# EasyEDA Pro project cap bank - Copy.eprj

# Schematic Schematic1
Board Name: Board1; Create Date: 2025-07-01; Page Name: P1; Project Name: cap bank - Copy; Schematic Name: Schematic1; Update Date: 2025-08-21; Company: EasyEDA.com; Page Size: A4; Version: V1.0
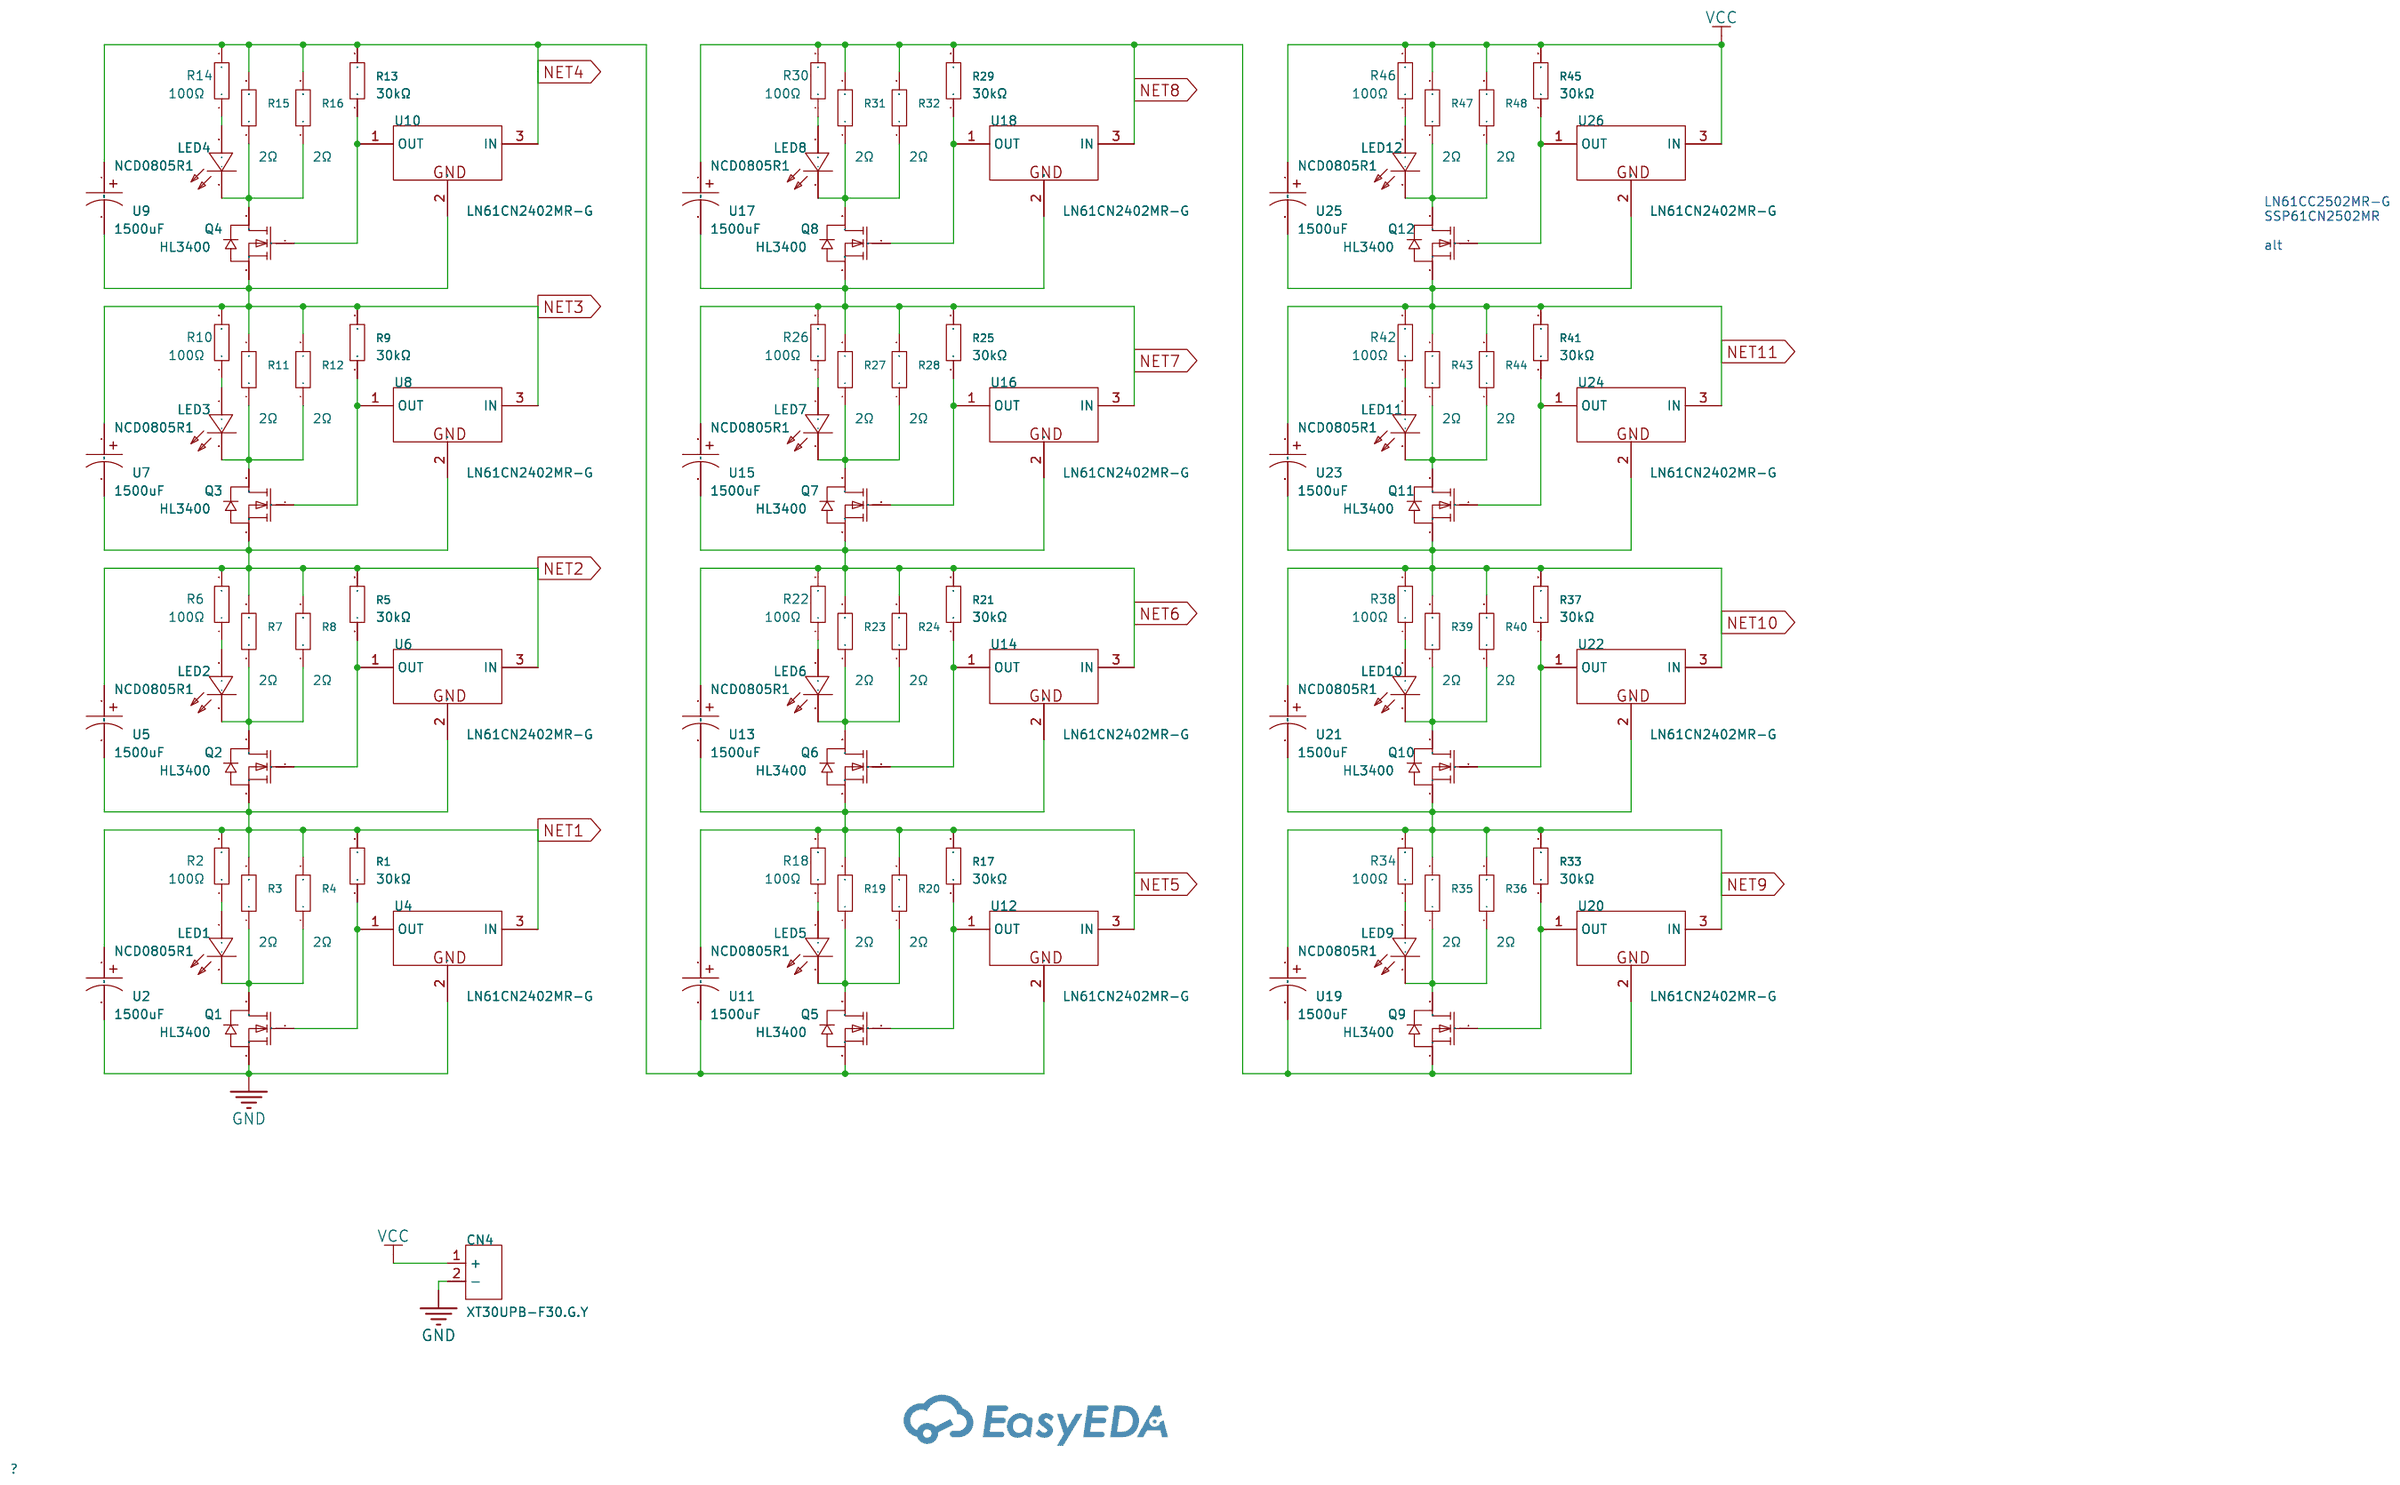
[diagram p0: schematic sheet]

## Parts
CN4  XT30UPB-F30.G.Y  [CONN-TH_XT30UPB-F]
LED1  NCD0805R1  [LED0805-R-RD]
LED2  NCD0805R1  [LED0805-R-RD]
LED3  NCD0805R1  [LED0805-R-RD]
LED4  NCD0805R1  [LED0805-R-RD]
LED5  NCD0805R1  [LED0805-R-RD]
LED6  NCD0805R1  [LED0805-R-RD]
LED7  NCD0805R1  [LED0805-R-RD]
LED8  NCD0805R1  [LED0805-R-RD]
LED9  NCD0805R1  [LED0805-R-RD]
LED10  NCD0805R1  [LED0805-R-RD]
LED11  NCD0805R1  [LED0805-R-RD]
LED12  NCD0805R1  [LED0805-R-RD]
Q1  HL3400  [SOT-23-3_L2.9-W1.3-P1.90-LS2.4-BR]
Q2  HL3400  [SOT-23-3_L2.9-W1.3-P1.90-LS2.4-BR]
Q3  HL3400  [SOT-23-3_L2.9-W1.3-P1.90-LS2.4-BR]
Q4  HL3400  [SOT-23-3_L2.9-W1.3-P1.90-LS2.4-BR]
Q5  HL3400  [SOT-23-3_L2.9-W1.3-P1.90-LS2.4-BR]
Q6  HL3400  [SOT-23-3_L2.9-W1.3-P1.90-LS2.4-BR]
Q7  HL3400  [SOT-23-3_L2.9-W1.3-P1.90-LS2.4-BR]
Q8  HL3400  [SOT-23-3_L2.9-W1.3-P1.90-LS2.4-BR]
Q9  HL3400  [SOT-23-3_L2.9-W1.3-P1.90-LS2.4-BR]
Q10  HL3400  [SOT-23-3_L2.9-W1.3-P1.90-LS2.4-BR]
Q11  HL3400  [SOT-23-3_L2.9-W1.3-P1.90-LS2.4-BR]
Q12  HL3400  [SOT-23-3_L2.9-W1.3-P1.90-LS2.4-BR]
R1  30kΩ  [R0805]
R2  100Ω  [R0805]
R3  2Ω  [R2512]
R4  2Ω  [R2512]
R5  30kΩ  [R0805]
R6  100Ω  [R0805]
R7  2Ω  [R2512]
R8  2Ω  [R2512]
R9  30kΩ  [R0805]
R10  100Ω  [R0805]
R11  2Ω  [R2512]
R12  2Ω  [R2512]
R13  30kΩ  [R0805]
R14  100Ω  [R0805]
R15  2Ω  [R2512]
R16  2Ω  [R2512]
R17  30kΩ  [R0805]
R18  100Ω  [R0805]
R19  2Ω  [R2512]
R20  2Ω  [R2512]
R21  30kΩ  [R0805]
R22  100Ω  [R0805]
R23  2Ω  [R2512]
R24  2Ω  [R2512]
R25  30kΩ  [R0805]
R26  100Ω  [R0805]
R27  2Ω  [R2512]
R28  2Ω  [R2512]
R29  30kΩ  [R0805]
R30  100Ω  [R0805]
R31  2Ω  [R2512]
R32  2Ω  [R2512]
R33  30kΩ  [R0805]
R34  100Ω  [R0805]
R35  2Ω  [R2512]
R36  2Ω  [R2512]
R37  30kΩ  [R0805]
R38  100Ω  [R0805]
R39  2Ω  [R2512]
R40  2Ω  [R2512]
R41  30kΩ  [R0805]
R42  100Ω  [R0805]
R43  2Ω  [R2512]
R44  2Ω  [R2512]
R45  30kΩ  [R0805]
R46  100Ω  [R0805]
R47  2Ω  [R2512]
R48  2Ω  [R2512]
U2  1500uF  [CAP-TH_BD18.0-P7.50-D0.8-FD]
U4  LN61CN2402MR-G  [SOT-23_L2.9-W1.3-P1.90-LS2.4-BR]
U5  1500uF  [CAP-TH_BD18.0-P7.50-D0.8-FD]
U6  LN61CN2402MR-G  [SOT-23_L2.9-W1.3-P1.90-LS2.4-BR]
U7  1500uF  [CAP-TH_BD18.0-P7.50-D0.8-FD]
U8  LN61CN2402MR-G  [SOT-23_L2.9-W1.3-P1.90-LS2.4-BR]
U9  1500uF  [CAP-TH_BD18.0-P7.50-D0.8-FD]
U10  LN61CN2402MR-G  [SOT-23_L2.9-W1.3-P1.90-LS2.4-BR]
U11  1500uF  [CAP-TH_BD18.0-P7.50-D0.8-FD]
U12  LN61CN2402MR-G  [SOT-23_L2.9-W1.3-P1.90-LS2.4-BR]
U13  1500uF  [CAP-TH_BD18.0-P7.50-D0.8-FD]
U14  LN61CN2402MR-G  [SOT-23_L2.9-W1.3-P1.90-LS2.4-BR]
U15  1500uF  [CAP-TH_BD18.0-P7.50-D0.8-FD]
U16  LN61CN2402MR-G  [SOT-23_L2.9-W1.3-P1.90-LS2.4-BR]
U17  1500uF  [CAP-TH_BD18.0-P7.50-D0.8-FD]
U18  LN61CN2402MR-G  [SOT-23_L2.9-W1.3-P1.90-LS2.4-BR]
U19  1500uF  [CAP-TH_BD18.0-P7.50-D0.8-FD]
U20  LN61CN2402MR-G  [SOT-23_L2.9-W1.3-P1.90-LS2.4-BR]
U21  1500uF  [CAP-TH_BD18.0-P7.50-D0.8-FD]
U22  LN61CN2402MR-G  [SOT-23_L2.9-W1.3-P1.90-LS2.4-BR]
U23  1500uF  [CAP-TH_BD18.0-P7.50-D0.8-FD]
U24  LN61CN2402MR-G  [SOT-23_L2.9-W1.3-P1.90-LS2.4-BR]
U25  1500uF  [CAP-TH_BD18.0-P7.50-D0.8-FD]
U26  LN61CN2402MR-G  [SOT-23_L2.9-W1.3-P1.90-LS2.4-BR]

## Library data of the parts
CN4 = XT30UPB-F30.G.Y: Power:- Output:- Input:- Size:- Interface:- Type:- Colour:Yellow MaximumCurrent:- Type:Aviation model plug RatedVoltage:DC 500V Type1:- NumberOfUSBHoles:- InterfaceType:Female MetalMaterial:Gold plating InsulationMaterial:PA RatedCurrent:15A RecommendedWi; LCSC Part Name: AMASS(艾迈斯)直立焊板式连接器XT30UPB30-F.G.*; Supplier Part: C108769; Manufacturer: AMASS(艾迈斯); JLCPCB Part Class: Extended Part; Datasheet: https://item.szlcsc.com/datasheet/XT30UPB-F30.G.Y/109989.html; Supplier: LCSC; Type: Aviation model plug; Colour: Yellow; RatedVoltage: DC 500V; InterfaceType: Female; MetalMaterial: Gold plating; InsulationMaterial: PA; RatedCurrent: 15A; contact resistance: 0.65mΩ
LED1-LED12 = NCD0805R1_C84256: Supplier Part: C84256; Manufacturer: 国星光电; Supplier Footprint: 0805; JLCPCB Part Class: Basic Part; Datasheet: https://atta.szlcsc.com/upload/public/pdf/source/20200820/C84256_F0A75A43B3EAD75808600A0514C76B99.pdf; Supplier: LCSC; Emitted Color: Red; Forward Voltage (VF): 1.6V~2.6V; Power Dissipation: 65mW; Forward Current: 20mA; Dominant Wavelength: 615nm~630nm; Diode Configuration: 独立二极管; Lens Color: 无色透明透镜; Luminous Intensity: 67mcd~195mcd; Viewing Angle: 130°; Operating Temperature: -30℃~+85℃
Q1-Q12 = HL3400: LCSC Part Name: N-通道,电流:5.6A,耐压:30V; Supplier Part: C22469448; Manufacturer: 宏嘉诚; Supplier Footprint: SOT-23; JLCPCB Part Class: Extended Part; Datasheet: https://atta.szlcsc.com/upload/public/pdf/source/20250106/821A5FA5B3A156C0B96C3BD3FAAD026C.pdf; Supplier: LCSC; Type: 1 N-channel; Drain to Source Voltage: 30V; Current - Continuous Drain(Id): 5.6A; RDS(on): 33mΩ@4.5V,5A; Pd - Power Dissipation: 1.2W; Gate Threshold Voltage (Vgs(th)@Id): 1.5V; Gate Charge(Qg): 17nC@4.5V; Input Capacitance(Ciss@Vds): 630pF@15V; Reverse Transfer Capacitance (Crss@Vds): 71pF@15V; Operating Temperature: -55℃~+150℃
R1 R5 R9 R13 R17 R21 R25 R29 R33 R37 R41 R45 = 0805W8F3002T5E: LCSC Part Name: 30kΩ ±1% 125mW 厚膜电阻; Supplier Part: C17621; Manufacturer: UNI-ROYAL(厚声); Supplier Footprint: 0805; JLCPCB Part Class: Basic Part; Datasheet: https://atta.szlcsc.com/upload/public/pdf/source/20200306/C422600_1E6D84923E4A46A82E41ADD87F860B5C.pdf; Supplier: LCSC; Type: Thick Film Resistors; Tolerance: ±1%; Temperature Coefficient: ±100ppm/℃; Operating Temperature Range: -55℃~+155℃
R2 R6 R10 R14 R18 R22 R26 R30 R34 R38 R42 R46 = 0805W8F1000T5E_C17408: LCSC Part Name: 100Ω ±1% 125mW 厚膜电阻; Supplier Part: C17408; Manufacturer: UNI-ROYAL(厚声); Manufacturer Part: 0805W8F1000T5E; Supplier Footprint: 0805; JLCPCB Part Class: Basic Part; Datasheet: https://atta.szlcsc.com/upload/public/pdf/source/20200306/C422600_1E6D84923E4A46A82E41ADD87F860B5C.pdf; Supplier: LCSC; Type: Thick Film Resistors; Tolerance: ±1%; Temperature Coefficient: ±100ppm/℃; Operating Temperature Range: -55℃~+155℃
R3 R4 R7 R8 R11 R12 R15 R16 R19 R20 R23 R24 R27 R28 R31 R32 R35 R36 R39 R40 R43 R44 R47 R48 = FRC2512J2R0TS: Type:Thick Film Resistors Resistance:2Ω Tolerance:±5% Tolerance:±5% Power(Watts):1W Voltage-Supply(Max):200V Temperature Coefficient:±200ppm/℃ Temperature Coefficient:±200ppm/℃; LCSC Part Name: 2Ω ±5% 1W 厚膜电阻; Supplier Part: C3000637; Manufacturer: FOJAN(富捷); Supplier Footprint: 2512; JLCPCB Part Class: Extended Part; Datasheet: https://atta.szlcsc.com/upload/public/pdf/source/20211221/925EC7D7225764EE0046F22065062C87.pdf; Supplier: LCSC; Type: Thick Film Resistors; Tolerance: ±5%; Power(Watts): 1W; Voltage-Supply(Max): 200V; Temperature Coefficient: ±200ppm/℃
U2 U5 U7 U9 U11 U13 U15 U17 U19 U21 U23 U25 = 80ZLH1500MEFC18X40: LCSC Part Name: 1500uF ±20% 80V; Supplier Part: C700879; Manufacturer: rubycon(红宝石); Supplier Footprint: 插件,D18xL40mm; JLCPCB Part Class: Extended Part; Datasheet: https://atta.szlcsc.com/upload/public/pdf/source/20200710/C700879_22A88F1D2FB7159B35BD93EA845084AE.pdf; Supplier: LCSC; Tolerance: ±20%; Lead Spacing: 7.5mm; Operating Temperature: -40℃~+105℃
U4 U6 U8 U10 U12 U14 U16 U18 U20 U22 U24 U26 = LN61CN2402MR-G: Supplier Part: C141418; Manufacturer: natlinear(南麟); Supplier Footprint: SOT-23; JLCPCB Part Class: Extended Part; Datasheet: https://atta.szlcsc.com/upload/public/pdf/source/20171110/C141418_15102792347801104211.pdf; Supplier: LCSC

## Nets
GND: CN4.2(-) Q1.2(S) U2.2 U4.2(GND)
VCC: CN4.1(+) R45.2 R46.2 R47.2 R48.2 U25.1 U26.3(IN)
NET1: Q2.2(S) R1.2 R2.2 R3.2 R4.2 U2.1 U4.3(IN) U5.2 U6.2(GND)
NET2: Q3.2(S) R5.2 R6.2 R7.2 R8.2 U5.1 U6.3(IN) U7.2 U8.2(GND)
NET3: Q4.2(S) R9.2 R10.2 R11.2 R12.2 U7.1 U8.3(IN) U9.2 U10.2(GND)
NET4: Q5.2(S) R13.2 R14.2 R15.2 R16.2 U9.1 U10.3(IN) U11.2 U12.2(GND)
NET5: Q6.2(S) R17.2 R18.2 R19.2 R20.2 U11.1 U12.3(IN) U13.2 U14.2(GND)
NET6: Q7.2(S) R21.2 R22.2 R23.2 R24.2 U13.1 U14.3(IN) U15.2 U16.2(GND)
NET7: Q8.2(S) R25.2 R26.2 R27.2 R28.2 U15.1 U16.3(IN) U17.2 U18.2(GND)
NET8: Q9.2(S) R29.2 R30.2 R31.2 R32.2 U17.1 U18.3(IN) U19.2 U20.2(GND)
NET9: Q10.2(S) R33.2 R34.2 R35.2 R36.2 U19.1 U20.3(IN) U21.2 U22.2(GND)
NET10: Q11.2(S) R37.2 R38.2 R39.2 R40.2 U21.1 U22.3(IN) U23.2 U24.2(GND)
NET11: Q12.2(S) R41.2 R42.2 R43.2 R44.2 U23.1 U24.3(IN) U25.2 U26.2(GND)
$1N471: LED1.1(+) R2.1
$1N732: LED1.2(-) Q1.3(D) R3.1 R4.1
$1N777: Q1.1(G) R1.1 U4.1(OUT)
$1N2020: LED2.1(+) R6.1
$1N2021: LED2.2(-) Q2.3(D) R7.1 R8.1
$1N2022: Q2.1(G) R5.1 U6.1(OUT)
$1N2372: LED3.1(+) R10.1
$1N2373: LED3.2(-) Q3.3(D) R11.1 R12.1
$1N2374: Q3.1(G) R9.1 U8.1(OUT)
$1N2721: LED4.1(+) R14.1
$1N2722: LED4.2(-) Q4.3(D) R15.1 R16.1
$1N2723: Q4.1(G) R13.1 U10.1(OUT)
$1N3070: LED5.1(+) R18.1
$1N3071: LED5.2(-) Q5.3(D) R19.1 R20.1
$1N3072: Q5.1(G) R17.1 U12.1(OUT)
$1N3398: LED6.1(+) R22.1
$1N3399: LED6.2(-) Q6.3(D) R23.1 R24.1
$1N3400: Q6.1(G) R21.1 U14.1(OUT)
$1N3726: LED7.1(+) R26.1
$1N3727: LED7.2(-) Q7.3(D) R27.1 R28.1
$1N3728: Q7.1(G) R25.1 U16.1(OUT)
$1N4054: LED8.1(+) R30.1
$1N4055: LED8.2(-) Q8.3(D) R31.1 R32.1
$1N4056: Q8.1(G) R29.1 U18.1(OUT)
$1N4382: LED9.1(+) R34.1
$1N4383: LED9.2(-) Q9.3(D) R35.1 R36.1
$1N4384: Q9.1(G) R33.1 U20.1(OUT)
$1N4710: LED10.1(+) R38.1
$1N4711: LED10.2(-) Q10.3(D) R39.1 R40.1
$1N4712: Q10.1(G) R37.1 U22.1(OUT)
$1N5038: LED11.1(+) R42.1
$1N5039: LED11.2(-) Q11.3(D) R43.1 R44.1
$1N5040: Q11.1(G) R41.1 U24.1(OUT)
$1N5366: LED12.1(+) R46.1
$1N5367: LED12.2(-) Q12.3(D) R47.1 R48.1
$1N5368: Q12.1(G) R45.1 U26.1(OUT)

## Notes on the sheet
- LN61CC2502MR-G
  SSP61CN2502MR
  alt

# Schematic Schematic2
Board Name: Board2; Create Date: 2025-07-04; Page Name: P1; Project Name: cap bank; Schematic Name: Schematic2; Update Date: 2025-07-04; Company: EasyEDA.com; Page Size: A4; Version: V1.0
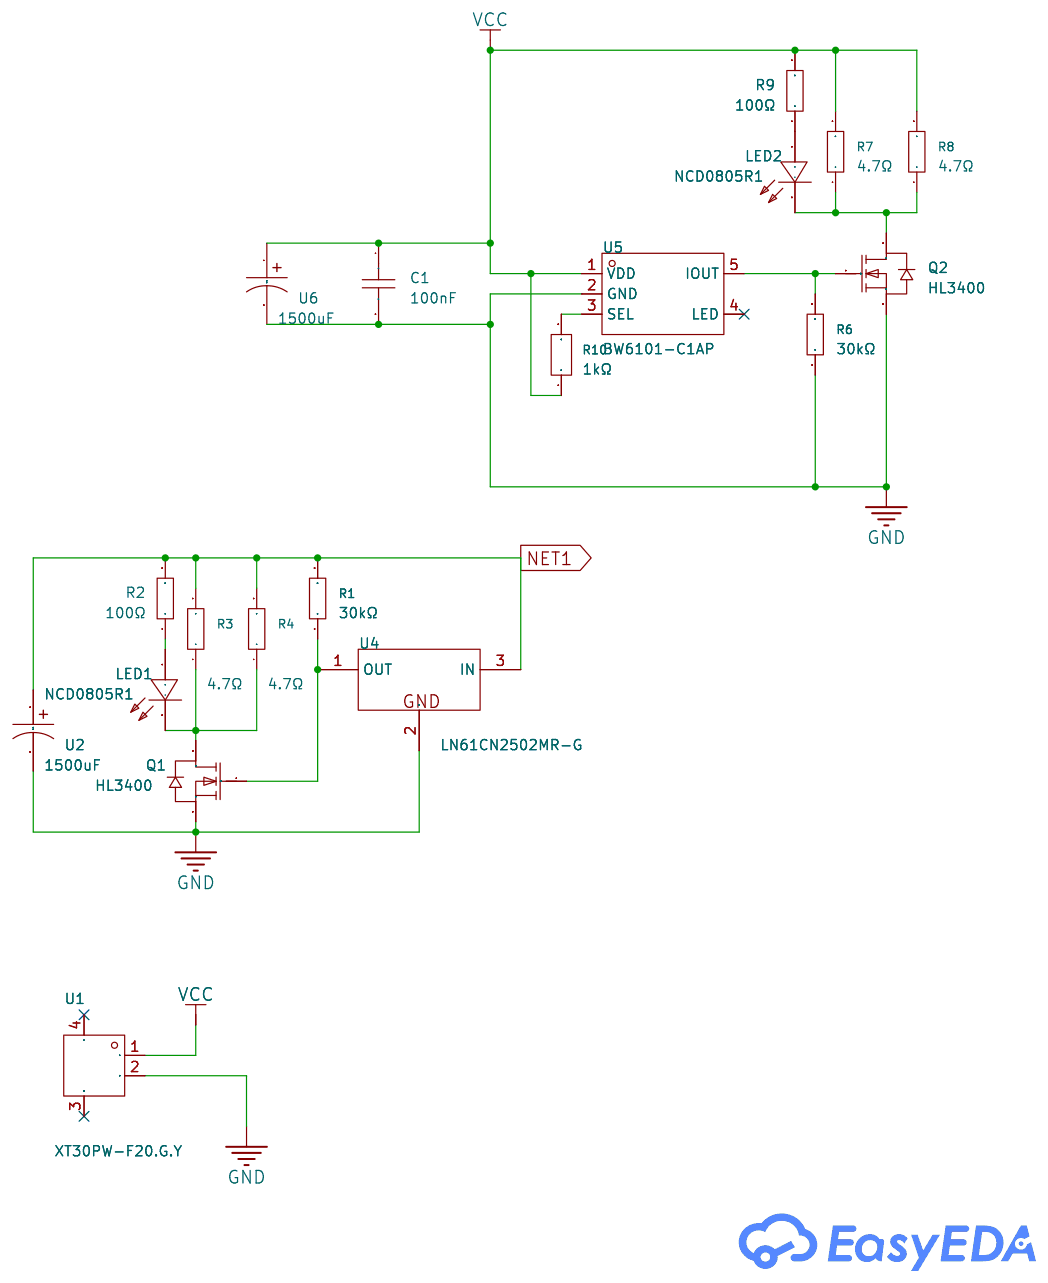
[diagram p1: schematic sheet]

## Parts
C1  100nF  [C0805]
LED1  NCD0805R1  [LED0805-R-RD]
LED2  NCD0805R1  [LED0805-R-RD]
Q1  HL3400  [SOT-23-3_L2.9-W1.3-P1.90-LS2.4-BR]
Q2  HL3400  [SOT-23-3_L2.9-W1.3-P1.90-LS2.4-BR]
R1  30kΩ  [R0805]
R2  100Ω  [R0805]
R3  4.7Ω  [R2512]
R4  4.7Ω  [R2512]
R6  30kΩ  [R0805]
R7  4.7Ω  [R2512]
R8  4.7Ω  [R2512]
R9  100Ω  [R0805]
R10  1kΩ  [R0805]
U1  XT30PW-F20.G.Y  [CONN-TH_XT30PW-F-1]
U2  1500uF  [CAP-TH_BD18.0-P7.50-D0.8-FD]
U4  LN61CN2502MR-G  [SOT-23-3_L2.9-W1.6-P1.90-LS2.8-BR]
U5  BW6101-C1AP  [SOT-23-5_L2.9-W1.6-P0.95-LS2.8-BL]
U6  1500uF  [CAP-TH_BD18.0-P7.50-D0.8-FD]

## Library data of the parts
C1 = FCC0805B104K500DT: LCSC Part Name: 100nF ±10% 50V; Supplier Part: C5137467; Manufacturer: FOJAN(富捷); Supplier Footprint: 0805; JLCPCB Part Class: Extended Part; Datasheet: https://atta.szlcsc.com/upload/public/pdf/source/20220818/0EB3B7FB2F5648AC16609637FBA7DABE.pdf; Supplier: LCSC; Tolerance: ±10%; Voltage Rating: 50V; Temperature Coefficient: X7R
LED1 LED2 = NCD0805R1_C84256: Supplier Part: C84256; Manufacturer: 国星光电; Supplier Footprint: 0805; JLCPCB Part Class: Basic Part; Datasheet: https://atta.szlcsc.com/upload/public/pdf/source/20200820/C84256_F0A75A43B3EAD75808600A0514C76B99.pdf; Supplier: LCSC; Emitted Color: Red; Forward Voltage (VF): 1.6V~2.6V; Power Dissipation: 65mW; Forward Current: 20mA; Dominant Wavelength: 615nm~630nm; Diode Configuration: 独立二极管; Lens Color: 无色透明透镜; Luminous Intensity: 67mcd~195mcd; Viewing Angle: 130°; Operating Temperature: -30℃~+85℃
Q1 Q2 = HL3400: LCSC Part Name: N-通道,电流:5.6A,耐压:30V; Supplier Part: C22469448; Manufacturer: 宏嘉诚; Supplier Footprint: SOT-23; JLCPCB Part Class: Extended Part; Datasheet: https://atta.szlcsc.com/upload/public/pdf/source/20250106/821A5FA5B3A156C0B96C3BD3FAAD026C.pdf; Supplier: LCSC; Type: 1 N-channel; Drain to Source Voltage: 30V; Current - Continuous Drain(Id): 5.6A; RDS(on): 33mΩ@4.5V,5A; Pd - Power Dissipation: 1.2W; Gate Threshold Voltage (Vgs(th)@Id): 1.5V; Gate Charge(Qg): 17nC@4.5V; Input Capacitance(Ciss@Vds): 630pF@15V; Reverse Transfer Capacitance (Crss@Vds): 71pF@15V; Operating Temperature: -55℃~+150℃
R1 R6 = 0805W8F3002T5E: LCSC Part Name: 30kΩ ±1% 125mW 厚膜电阻; Supplier Part: C17621; Manufacturer: UNI-ROYAL(厚声); Supplier Footprint: 0805; JLCPCB Part Class: Basic Part; Datasheet: https://atta.szlcsc.com/upload/public/pdf/source/20200306/C422600_1E6D84923E4A46A82E41ADD87F860B5C.pdf; Supplier: LCSC; Type: Thick Film Resistors; Tolerance: ±1%; Temperature Coefficient: ±100ppm/℃; Operating Temperature Range: -55℃~+155℃
R2 R9 = 0805W8F1000T5E_C17408: LCSC Part Name: 100Ω ±1% 125mW 厚膜电阻; Supplier Part: C17408; Manufacturer: UNI-ROYAL(厚声); Manufacturer Part: 0805W8F1000T5E; Supplier Footprint: 0805; JLCPCB Part Class: Basic Part; Datasheet: https://atta.szlcsc.com/upload/public/pdf/source/20200306/C422600_1E6D84923E4A46A82E41ADD87F860B5C.pdf; Supplier: LCSC; Type: Thick Film Resistors; Tolerance: ±1%; Temperature Coefficient: ±100ppm/℃; Operating Temperature Range: -55℃~+155℃
R3 R4 R7 R8 = 25121WJ047JT4E: LCSC Part Name: 4.7Ω ±5% 1W 厚膜电阻; Supplier Part: C25489; Manufacturer: UNI-ROYAL(厚声); Supplier Footprint: 2512; JLCPCB Part Class: Extended Part; Datasheet: https://atta.szlcsc.com/upload/public/pdf/source/20200306/C422600_1E6D84923E4A46A82E41ADD87F860B5C.pdf; Supplier: LCSC; Type: Thick Film Resistors; Tolerance: ±5%; Temperature Coefficient: ±200ppm/℃; Operating Temperature Range: -55℃~+155℃
R10 = FRC0805J102 TS: LCSC Part Name: 1kΩ ±5% 125mW 厚膜电阻; Supplier Part: C2907295; Manufacturer: FOJAN(富捷); Supplier Footprint: 0805; JLCPCB Part Class: Extended Part; Datasheet: https://atta.szlcsc.com/upload/public/pdf/source/20211221/925EC7D7225764EE0046F22065062C87.pdf; Supplier: LCSC; Type: Thick Film Resistors; Tolerance: ±5%; Temperature Coefficient: ±100ppm/℃; Operating Temperature Range: -55℃~+155℃
U1 = XT30PW-F20.G.Y: Power:- Output:- Input:- Size:- Interface:- Type:- Colour:- MaximumCurrent:- Type:航模插头 RatedVoltage:- Type1:- NumberOfUSBHoles:- InterfaceType:母头 MetalMaterial:- InsulationMaterial:- RatedCurrent:- RecommendedWireGauge:- FlameRetardantGrade:- contact resi; LCSC Part Name: AMASS(艾迈斯)电源连接器 母头 XT30PW-F; Supplier Part: C2913282; Manufacturer: AMASS(艾迈斯); JLCPCB Part Class: Extended Part; Datasheet: https://atta.szlcsc.com/upload/public/pdf/source/20231218/06CFCF98887A9A87638B0856A725C8FD.pdf; Supplier: LCSC; Type: 航模插头; InterfaceType: 母头
U2 U6 = 80ZLH1500MEFC18X40: LCSC Part Name: 1500uF ±20% 80V; Supplier Part: C700879; Manufacturer: rubycon(红宝石); Supplier Footprint: 插件,D18xL40mm; JLCPCB Part Class: Extended Part; Datasheet: https://atta.szlcsc.com/upload/public/pdf/source/20200710/C700879_22A88F1D2FB7159B35BD93EA845084AE.pdf; Supplier: LCSC; Tolerance: ±20%; Lead Spacing: 7.5mm; Operating Temperature: -40℃~+105℃
U4 = LN61CN2502MR-G: LCSC Part Name: 高精度 低功耗 小封装 电压检测芯片; Supplier Part: C3008034; Manufacturer: natlinear(南麟); Supplier Footprint: SOT-23-3L; JLCPCB Part Class: Extended Part; Datasheet: https://atta.szlcsc.com/upload/public/pdf/source/20220425/1D5109EE5993FFA3DF00E8F2F8419593.pdf; Supplier: LCSC
U5 = BW6101-C1AP: Supplier Part: C511549; Supplier Footprint: SOT-23-5L; JLCPCB Part Class: Extended Part; Supplier: LCSC

## Nets
GND: C1.2 Q1.2(S) Q2.2(S) R6.1 U1.2 U2.2 U4.2(GND) U5.2(GND) U6.2
VCC: C1.1 R7.2 R8.2 R9.2 R10.1 U1.1 U5.1(VDD) U6.1
NET1: R1.2 R2.2 R3.2 R4.2 U2.1 U4.3(IN)
Net-(LED1-1): LED1.1(+) R2.1
Net-(LED1-2): LED1.2(-) Q1.3(D) R3.1 R4.1
Net-(LED2-1): LED2.1(+) R9.1
Net-(LED2-2): LED2.2(-) Q2.3(D) R7.1 R8.1
Net-(Q1-1): Q1.1(G) R1.1 U4.1(OUT)
Net-(Q2-1): Q2.1(G) R6.2 U5.5(IOUT)
Net-(R10-2): R10.2 U5.3(SEL)

Not connected (* = marked no-connect by the designer): U1 3* 4*; U5 4(LED)*

# Board PCB1_1
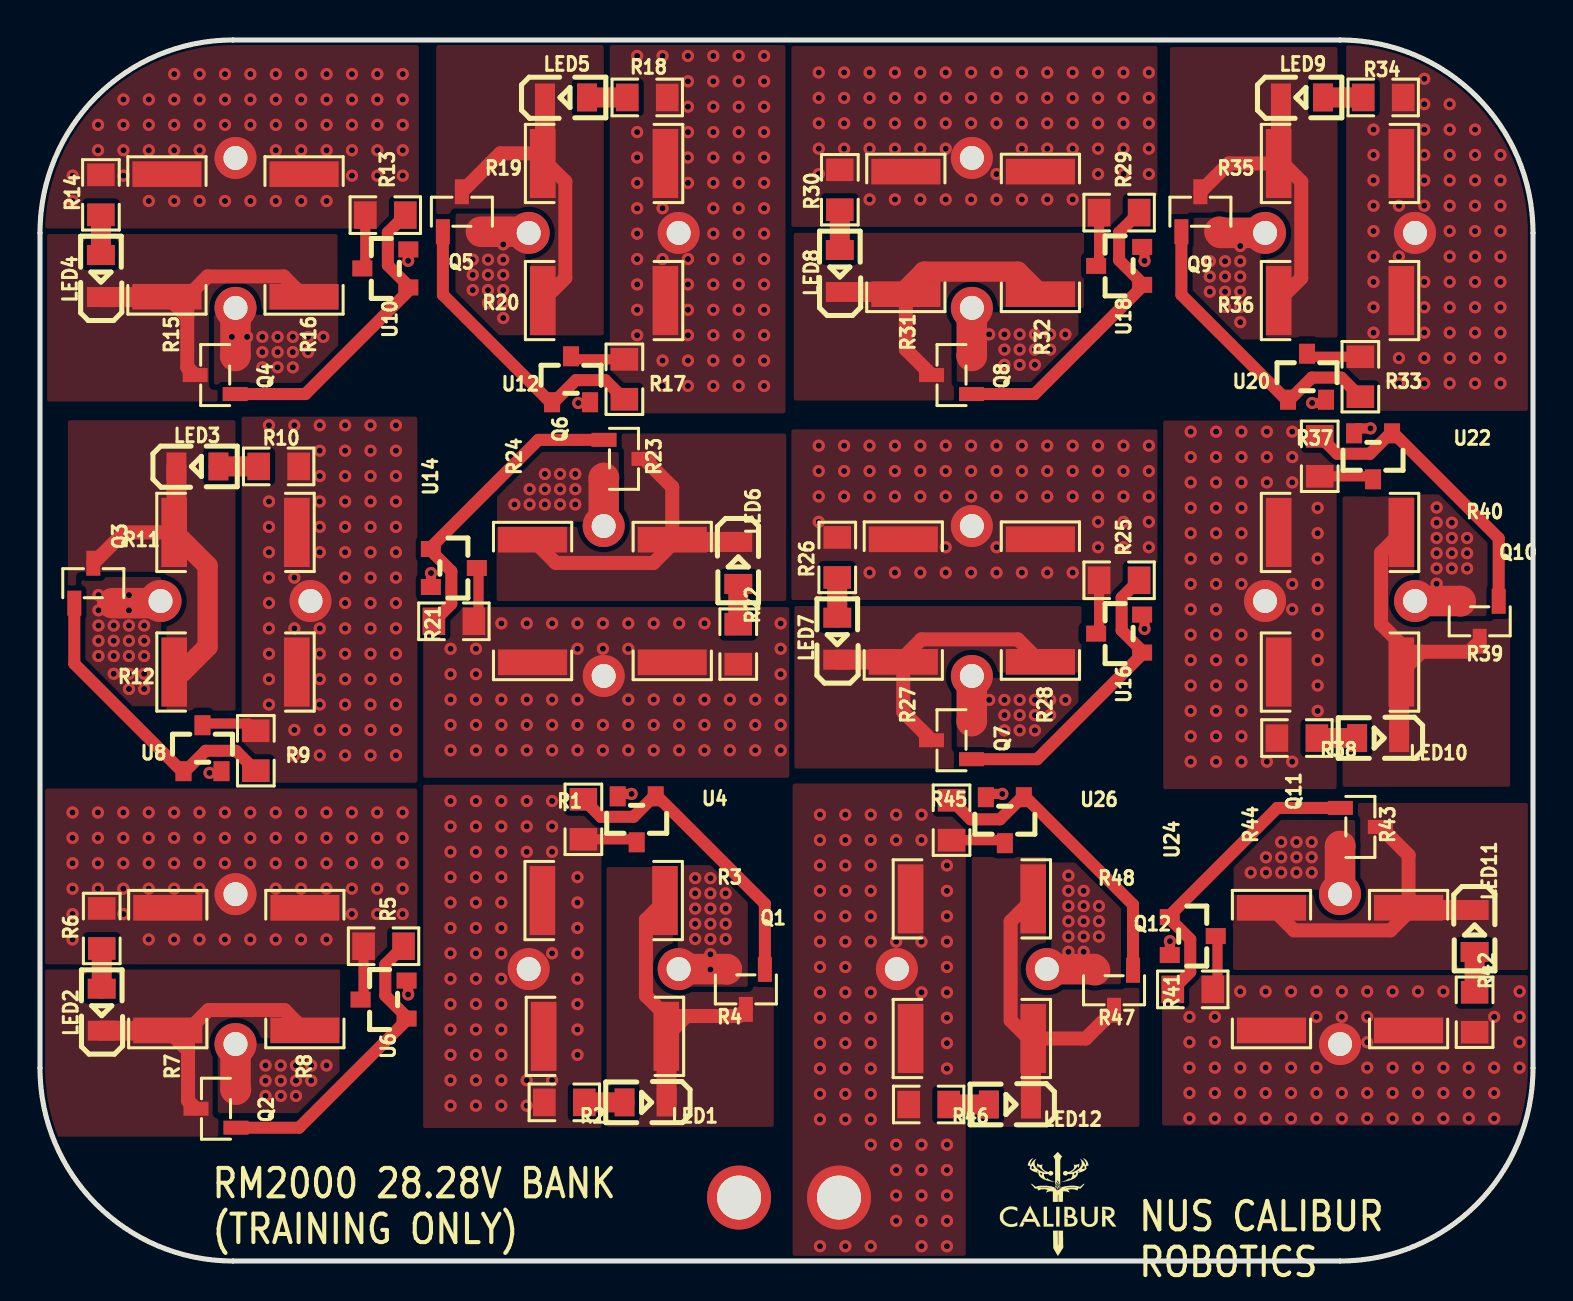
[diagram p2: board, top side]
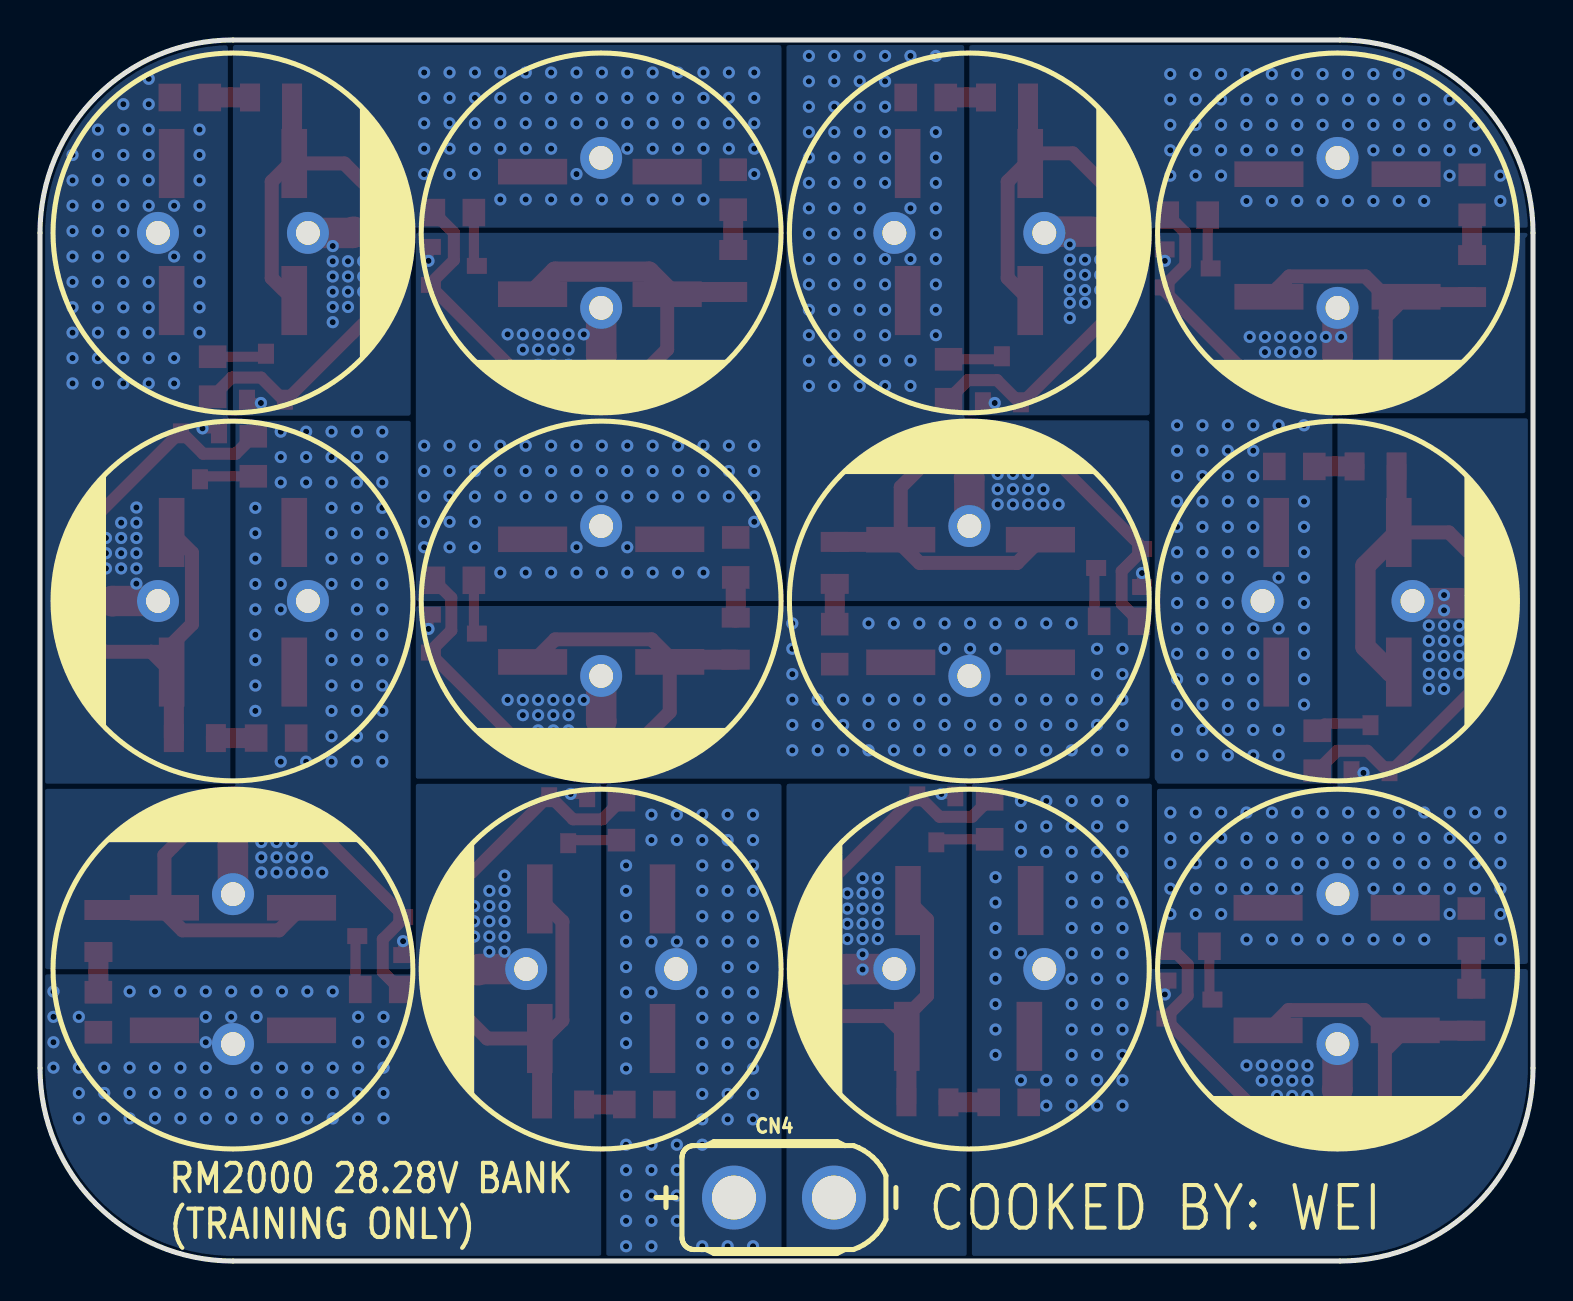
[diagram p3: board, bottom side, seen from below]

Outline 74.68 x 61.09 mm; copper layers: Top Layer, Bottom Layer. Coordinates in mm from the lower left corner of the outline.
Outline path: 0,51.43 0,9.65 arc(2.83,2.83) 9.65,0 65.02,0 arc(71.85,2.83) 74.68,9.65 74.68,51.43 arc(71.85,58.26) 65.02,61.09 9.65,61.09 arc(2.83,58.26) 0,51.43
Stack: Top Layer 0.035mm / Dielectric1 1.51mm FR4 er 4.5 / Bottom Layer 0.035mm

## Design rules (mm)
template: Custom Config
spacing copperThickness1oz (default): track to track 0.102, other pairs 0.152 to 0.3
spacing copperThickness2oz: track to track 0.203, other pairs 0.152 to 0.3
track width copperThickness1oz (default): min 0.127, default 0.508, max 2.54
track width copperThickness2oz: min 0.203, default 0.254, max 2.54
differential pair differentialPair (default): width min 0.127, default 0.254, max 2.54; gap min 0.152, default 0.152
via viaSize (default): diameter min 0.5, default 0.61, max 10; hole min 0.3, default 0.305, max 6.3
net $1N732 uses copperRegion1
net GND uses copperRegion1
net $1N2021 uses copperRegion1
net $1N2373 uses copperRegion1
net $1N2722 uses copperRegion1
net $1N3071 uses copperRegion1
net $1N3399 uses copperRegion1
net $1N3727 uses copperRegion1
net $1N4055 uses copperRegion1
net $1N4383 uses copperRegion1
net $1N4711 uses copperRegion1
net $1N5039 uses copperRegion1
net $1N5367 uses copperRegion1
net $1N3072 uses copperRegion1
net VCC uses copperRegion1
net NET1 uses copperRegion1
net NET2 uses copperRegion1
net NET3 uses copperRegion1
net NET4 uses copperRegion1
net NET5 uses copperRegion1
net NET6 uses copperRegion1
net NET7 uses copperRegion1
net NET8 uses copperRegion1
net NET9 uses copperRegion1
net NET10 uses copperRegion1
net NET11 uses copperRegion1

## Placement (name value [footprint] x y rotation side)
CN4  XT30UPB-F30.G.Y  [CONN-TH_XT30UPB-F]  37.46 3.17 180 bottom
LED1  NCD0805R1  [LED0805-R-RD]  30.29 7.94 180 top
LED2  NCD0805R1  [LED0805-R-RD]  3.09 12.57 90 top
LED3  NCD0805R1  [LED0805-R-RD]  7.87 39.75 0 top
LED4  NCD0805R1  [LED0805-R-RD]  3.05 49.28 90 top
LED5  NCD0805R1  [LED0805-R-RD]  26.31 58.21 0 top
LED6  NCD0805R1  [LED0805-R-RD]  34.92 34.92 270 top
LED7  NCD0805R1  [LED0805-R-RD]  39.88 31.13 90 top
LED8  NCD0805R1  [LED0805-R-RD]  40.01 49.53 90 top
LED9  NCD0805R1  [LED0805-R-RD]  63.12 58.21 0 top
LED10  NCD0805R1  [LED0805-R-RD]  66.93 26.16 180 top
LED11  NCD0805R1  [LED0805-R-RD]  71.76 16.51 270 top
LED12  NCD0805R1  [LED0805-R-RD]  48.51 7.83 180 top
Q1  HL3400  [SOT-23-3_L2.9-W1.3-P1.90-LS2.4-BR]  35.31 13.59 90 top
Q2  HL3400  [SOT-23-3_L2.9-W1.3-P1.90-LS2.4-BR]  8.8 7.62 0 top
Q3  HL3400  [SOT-23-3_L2.9-W1.3-P1.90-LS2.4-BR]  2.67 33.91 270 top
Q4  HL3400  [SOT-23-3_L2.9-W1.3-P1.90-LS2.4-BR]  8.76 44.32 0 top
Q5  HL3400  [SOT-23-3_L2.9-W1.3-P1.90-LS2.4-BR]  21.1 52.49 270 top
Q6  HL3400  [SOT-23-3_L2.9-W1.3-P1.90-LS2.4-BR]  29.21 40.13 180 top
Q7  HL3400  [SOT-23-3_L2.9-W1.3-P1.90-LS2.4-BR]  45.59 26.05 0 top
Q8  HL3400  [SOT-23-3_L2.9-W1.3-P1.90-LS2.4-BR]  45.59 44.32 0 top
Q9  HL3400  [SOT-23-3_L2.9-W1.3-P1.90-LS2.4-BR]  58.04 52.49 270 top
Q10  HL3400  [SOT-23-3_L2.9-W1.3-P1.90-LS2.4-BR]  72.01 32 90 top
Q11  HL3400  [SOT-23-3_L2.9-W1.3-P1.90-LS2.4-BR]  66.04 21.72 180 top
Q12  HL3400  [SOT-23-3_L2.9-W1.3-P1.90-LS2.4-BR]  53.72 13.55 90 top
R1  30kΩ  [R0805]  27.18 22.1 270 top
R2  100Ω  [R0805]  26.23 7.94 180 top
R3  2Ω  [R2512]  28.19 18.03 180 top
R4  2Ω  [R2512]  28.26 11.24 180 top
R5  30kΩ  [R0805]  17.19 15.75 180 top
R6  100Ω  [R0805]  3.09 16.64 90 top
R7  2Ω  [R2512]  6.39 14.6 90 top
R8  2Ω  [R2512]  13.25 14.6 90 top
R9  30kΩ  [R0805]  10.8 25.53 90 top
R10  100Ω  [R0805]  11.94 39.75 0 top
R11  2Ω  [R2512]  9.78 36.45 0 top
R12  2Ω  [R2512]  9.78 29.47 0 top
R13  30kΩ  [R0805]  17.27 52.32 180 top
R14  100Ω  [R0805]  3.05 53.34 90 top
R15  2Ω  [R2512]  6.35 51.31 90 top
R16  2Ω  [R2512]  13.21 51.31 90 top
R17  30kΩ  [R0805]  29.23 44.11 90 top
R18  100Ω  [R0805]  30.37 58.21 0 top
R19  2Ω  [R2512]  28.21 54.91 0 top
R20  2Ω  [R2512]  28.21 48.05 0 top
R21  30kΩ  [R0805]  20.7 32 0 top
R22  100Ω  [R0805]  34.92 30.86 270 top
R23  2Ω  [R2512]  31.62 33.02 270 top
R24  2Ω  [R2512]  24.64 33.02 270 top
R25  30kΩ  [R0805]  53.97 34.06 180 top
R26  100Ω  [R0805]  39.88 35.2 90 top
R27  2Ω  [R2512]  43.18 33.04 90 top
R28  2Ω  [R2512]  50.04 33.04 90 top
R29  30kΩ  [R0805]  53.98 52.45 180 top
R30  100Ω  [R0805]  40.01 53.59 90 top
R31  2Ω  [R2512]  43.31 51.43 90 top
R32  2Ω  [R2512]  50.04 51.43 90 top
R33  30kΩ  [R0805]  66.04 44.24 90 top
R34  100Ω  [R0805]  67.18 58.21 0 top
R35  2Ω  [R2512]  65.02 54.91 0 top
R36  2Ω  [R2512]  65.02 48.05 0 top
R37  30kΩ  [R0805]  64.01 40.26 270 top
R38  100Ω  [R0805]  62.86 26.16 180 top
R39  2Ω  [R2512]  65.02 29.46 180 top
R40  2Ω  [R2512]  65.02 36.45 180 top
R41  30kΩ  [R0805]  57.66 13.59 0 top
R42  100Ω  [R0805]  71.76 12.45 270 top
R43  2Ω  [R2512]  68.45 14.6 270 top
R44  2Ω  [R2512]  61.6 14.6 270 top
R45  30kΩ  [R0805]  45.59 22.05 270 top
R46  100Ω  [R0805]  44.45 7.83 180 top
R47  2Ω  [R2512]  46.61 11.13 180 top
R48  2Ω  [R2512]  46.61 18.12 180 top
U2  1500uF  [CAP-TH_BD18.0-P7.50-D0.8-FD]  28.19 14.6 0 bottom
U4  LN61CN2402MR-G  [SOT-23_L2.9-W1.3-P1.90-LS2.4-BR]  29.85 22.1 90 top
U5  1500uF  [CAP-TH_BD18.0-P7.50-D0.8-FD]  9.78 14.6 270 bottom
U6  LN61CN2402MR-G  [SOT-23_L2.9-W1.3-P1.90-LS2.4-BR]  17.19 13.08 0 top
U7  1500uF  [CAP-TH_BD18.0-P7.50-D0.8-FD]  9.78 33.02 180 bottom
U8  LN61CN2402MR-G  [SOT-23_L2.9-W1.3-P1.90-LS2.4-BR]  8.13 25.66 270 top
U9  1500uF  [CAP-TH_BD18.0-P7.50-D0.8-FD]  9.78 51.43 270 bottom
U10  LN61CN2402MR-G  [SOT-23_L2.9-W1.3-P1.90-LS2.4-BR]  17.27 49.66 0 top
U11  1500uF  [CAP-TH_BD18.0-P7.50-D0.8-FD]  28.19 51.43 180 bottom
U12  LN61CN2402MR-G  [SOT-23_L2.9-W1.3-P1.90-LS2.4-BR]  26.56 44.11 270 top
U13  1500uF  [CAP-TH_BD18.0-P7.50-D0.8-FD]  28.19 33.02 90 bottom
U14  LN61CN2402MR-G  [SOT-23_L2.9-W1.3-P1.90-LS2.4-BR]  20.7 34.67 180 top
U15  1500uF  [CAP-TH_BD18.0-P7.50-D0.8-FD]  46.61 33.02 270 bottom
U16  LN61CN2402MR-G  [SOT-23_L2.9-W1.3-P1.90-LS2.4-BR]  53.97 31.39 0 top
U17  1500uF  [CAP-TH_BD18.0-P7.50-D0.8-FD]  46.61 51.43 270 bottom
U18  LN61CN2402MR-G  [SOT-23_L2.9-W1.3-P1.90-LS2.4-BR]  53.98 49.78 0 top
U19  1500uF  [CAP-TH_BD18.0-P7.50-D0.8-FD]  65.02 51.43 180 bottom
U20  LN61CN2402MR-G  [SOT-23_L2.9-W1.3-P1.90-LS2.4-BR]  63.37 44.24 270 top
U21  1500uF  [CAP-TH_BD18.0-P7.50-D0.8-FD]  65.02 33.02 0 bottom
U22  LN61CN2402MR-G  [SOT-23_L2.9-W1.3-P1.90-LS2.4-BR]  66.67 40.26 90 top
U23  1500uF  [CAP-TH_BD18.0-P7.50-D0.8-FD]  65.02 14.6 90 bottom
U24  LN61CN2402MR-G  [SOT-23_L2.9-W1.3-P1.90-LS2.4-BR]  57.66 16.26 180 top
U25  1500uF  [CAP-TH_BD18.0-P7.50-D0.8-FD]  46.61 14.6 0 bottom
U26  LN61CN2402MR-G  [SOT-23_L2.9-W1.3-P1.90-LS2.4-BR]  48.26 22.05 90 top

## Footprints (pads in the part's own frame, mm; a bottom-side part is the same pattern mirrored in y, then rotated)
CAP-TH_BD18.0-P7.50-D0.8-FD
  round 2.1 hole 1.2: 1(-3.75,0) 2(3.75,0)
CONN-TH_XT30UPB-F
  round 3.2 hole 2.2: 1(-2.5,0) 2(2.5,0)
LED0805-R-RD
  rect 1x1.399 smd: 1(1.05,0) 2(-1.05,0)
R0805
  rect 1.133x1.377 smd: 1(-1,0) 2(1,0)
R2512
  rect 1.282x3.456 smd: 1(-3.067,0) 2(3.067,0)
SOT-23-3_L2.9-W1.3-P1.90-LS2.4-BR
  rect 1.25x0.7 smd: 1(1,-0.95) 2(1,0.95) 3(-1,0)
SOT-23_L2.9-W1.3-P1.90-LS2.4-BR
  rect 1x0.8 smd: 1(1.15,-0.95) 2(1.15,0.95) 3(-1.15,0)

## Nets
As in the schematic.

## Via types
v1: diameter 0.61, hole 0.305, Top Layer to Bottom Layer, 938 vias

## Routing (per net, layer and track width the routed paths; a pad name or vN(x,y) marks a point on that pad's centre or on a via; arc(x,y) is an arc through that point)
GND: length 3.1
  Top Layer w0.508: v1(29.59,23.37) 28.93,23.37 28.89,23.33
  Top Layer w1.524: Q1.2 34.34,14.6 U2.2
  vias: v1(32.77,19.16) v1(32.77,18.39) v1(32.77,17.63) v1(32.77,16.87) v1(32.77,16.11) v1(33.53,19.16) v1(33.53,18.39) v1(33.53,17.63) v1(33.53,16.87) v1(33.53,16.11) v1(33.53,15.35) v1(33.53,14.58) v1(34.29,18.39) v1(34.29,17.63) v1(34.29,16.87) v1(34.29,16.11)
VCC: length 2.8
  Top Layer w0.508: R45.2 48.02,21.05 48.26,20.82
  vias: v1(39.01,22.33) v1(39.01,21.06) v1(39.01,19.79) v1(39.01,18.52) v1(39.01,17.25) v1(39.01,15.98) v1(39.01,14.71) v1(39.01,13.44) v1(39.01,12.17) v1(39.01,10.9) v1(39.01,9.63) v1(39.01,8.36) v1(39.01,7.09) v1(39.01,0.74) v1(40.28,22.33) v1(40.28,21.06) v1(40.28,19.79) v1(40.28,18.52) v1(40.28,17.25) v1(40.28,15.98) v1(40.28,14.71) v1(40.28,13.44) v1(40.28,12.17) v1(40.28,10.9) v1(40.28,9.63) v1(40.28,8.36) v1(40.28,7.09) v1(40.28,0.74) v1(41.55,22.33) v1(41.55,21.06) v1(41.55,19.79) v1(41.55,18.52) v1(41.55,17.25) v1(41.55,15.98) v1(41.55,13.44) v1(41.55,12.17) v1(41.55,10.9) v1(41.55,9.63) v1(41.55,8.36) v1(41.55,7.09) v1(41.55,5.82) v1(41.55,0.74) v1(42.82,22.33) v1(42.82,21.06) v1(42.82,15.98) v1(42.82,5.82) v1(42.82,4.55) v1(42.82,3.28) v1(42.82,2.01) v1(44.09,22.33) v1(44.09,21.06) v1(44.09,15.98) v1(44.09,13.44) v1(44.09,5.82) v1(44.09,4.55) v1(44.09,3.28) v1(44.09,2.01) v1(44.09,0.74) v1(45.36,19.79) v1(45.36,18.52) v1(45.36,17.25) v1(45.36,15.98) v1(45.36,14.71) v1(45.36,13.44) v1(45.36,12.17) v1(45.36,10.9) v1(45.36,9.63) v1(45.36,5.82) v1(45.36,4.55) v1(45.36,3.28) v1(45.36,2.01) v1(45.36,0.74)
NET1: length 5.8
  Top Layer w0.508: R1.2 29.61,21.1 29.85,20.86 ; 18.42,14.03 18.42,14.02 v1(18.42,13.33)
  Top Layer w1.524: Q2.2 9.78,8.59 U5.2
  vias: v1(11.28,9.78) v1(11.28,9.02) v1(11.28,8.26) v1(12.04,9.78) v1(12.04,9.02) v1(12.04,8.26) v1(12.81,9.78) v1(12.81,9.02) v1(12.81,8.26) v1(13.57,9.78) v1(13.57,9.02) v1(14.33,9.78) v1(20.53,23.01) v1(20.53,21.74) v1(20.53,20.47) v1(20.53,19.2) v1(20.53,17.93) v1(20.53,16.66) v1(20.53,15.39) v1(20.53,14.12) v1(20.53,12.85) v1(20.53,11.58) v1(20.53,10.31) v1(20.53,9.04) v1(20.53,7.77) v1(21.8,23.01) v1(21.8,21.74) v1(21.8,20.47) v1(21.8,19.2) v1(21.8,17.93) v1(21.8,16.66) v1(21.8,15.39) v1(21.8,14.12) v1(21.8,12.85) v1(21.8,11.58) v1(21.8,10.31) v1(21.8,9.04) v1(21.8,7.77) v1(23.07,23.01) v1(23.07,21.74) v1(23.07,20.47) v1(23.07,19.2) v1(23.07,17.93) v1(23.07,16.66) v1(23.07,15.39) v1(23.07,14.12) v1(23.07,12.85) v1(23.07,11.58) v1(23.07,10.31) v1(23.07,9.04) v1(23.07,7.77) v1(24.34,23.01) v1(24.34,21.74) v1(24.34,20.47) v1(24.34,9.04) v1(24.34,7.77) v1(25.61,23.01) v1(25.61,21.74) v1(25.61,20.47) v1(25.61,15.39) v1(25.61,9.04) v1(26.88,19.2) v1(26.88,17.93) v1(26.88,16.66) v1(26.88,15.39) v1(26.88,14.12) v1(26.88,12.85) v1(26.88,11.58) v1(26.88,10.31)
NET2: length 5.8
  Top Layer w0.508: 15.95,13.08 16.19,13.32 R5.2 ; 9.08,24.42 v1(8.48,24.42)
  Top Layer w1.524: U7.2 5.92,32.91 Q3.2
  vias: v1(1.63,22.44) v1(1.63,21.17) v1(1.63,19.9) v1(1.63,18.63) v1(1.63,17.36) v1(1.63,16.09) v1(2.93,33.32) v1(2.93,32.55) v1(2.93,31.79) v1(2.93,31.03) v1(2.93,30.27) v1(2.9,22.44) v1(2.9,21.17) v1(2.9,19.9) v1(2.9,18.63) v1(3.69,31.79) v1(3.69,31.03) v1(3.69,30.27) v1(3.69,29.38) v1(4.17,22.44) v1(4.17,21.17) v1(4.17,19.9) v1(4.17,18.63) v1(4.17,17.36) v1(4.45,33.32) v1(4.45,32.55) v1(4.45,31.79) v1(4.45,31.03) v1(4.45,30.27) v1(4.45,29.38) v1(4.45,28.62) v1(5.21,31.79) v1(5.21,31.03) v1(5.21,30.27) v1(5.21,29.38) v1(5.21,28.62) v1(5.44,22.44) v1(5.44,21.17) v1(5.44,19.9) v1(5.44,18.63) v1(5.44,16.09) v1(6.71,22.44) v1(6.71,21.17) v1(6.71,19.9) v1(6.71,18.63) v1(6.71,16.09) v1(7.98,22.44) v1(7.98,21.17) v1(7.98,19.9) v1(7.98,18.63) v1(7.98,16.09) v1(9.25,22.44) v1(9.25,21.17) v1(9.25,19.9) v1(9.25,16.09) v1(10.52,22.44) v1(10.52,21.17) v1(10.52,19.9) v1(10.52,16.09) v1(11.79,22.44) v1(11.79,21.17) v1(11.79,19.9) v1(11.79,18.63) v1(11.79,16.09) v1(13.06,22.44) v1(13.06,21.17) v1(13.06,19.9) v1(13.06,18.63) v1(13.06,16.09) v1(14.33,22.44) v1(14.33,21.17) v1(14.33,19.9) v1(14.33,18.63) v1(14.33,16.09) v1(15.6,22.44) v1(15.6,21.17) v1(15.6,19.9) v1(15.6,18.63) v1(15.6,17.36) v1(16.87,22.44) v1(16.87,21.17) v1(16.87,19.9) v1(16.87,18.63) v1(16.87,17.36) v1(18.14,22.44) v1(18.14,21.17) v1(18.14,19.9) v1(18.14,18.63) v1(18.14,17.36)
NET3: length 5.8
  Top Layer w0.508: v1(18.42,50.04) 18.42,50.51 18.51,50.61 ; R9.2 10.43,26.89 8.13,26.89
  Top Layer w1.524: U9.2 9.78,45.29 Q4.2
  vias: v1(9.6,46.23) v1(10.36,46.23) v1(11.12,46.23) v1(11.12,45.47) v1(11.12,44.71) v1(11.45,41.81) v1(11.45,38) v1(11.45,36.73) v1(11.45,35.46) v1(11.45,34.19) v1(11.45,32.92) v1(11.45,31.65) v1(11.45,30.38) v1(11.45,29.11) v1(11.45,27.84) v1(11.88,46.23) v1(11.88,45.47) v1(11.88,44.71) v1(12.65,46.23) v1(12.65,45.47) v1(12.65,44.71) v1(12.72,41.81) v1(12.72,34.19) v1(12.72,31.65) v1(12.72,26.57) v1(12.72,25.3) v1(13.41,46.23) v1(13.41,45.47) v1(13.99,41.81) v1(13.99,40.54) v1(13.99,39.27) v1(13.99,38) v1(13.99,36.73) v1(13.99,35.46) v1(13.99,31.65) v1(13.99,30.38) v1(13.99,29.11) v1(13.99,27.84) v1(13.99,26.57) v1(13.99,25.3) v1(14.17,46.23) v1(15.26,41.81) v1(15.26,40.54) v1(15.26,39.27) v1(15.26,38) v1(15.26,36.73) v1(15.26,35.46) v1(15.26,34.19) v1(15.26,32.92) v1(15.26,31.65) v1(15.26,30.38) v1(15.26,29.11) v1(15.26,27.84) v1(15.26,26.57) v1(15.26,25.3) v1(16.53,41.81) v1(16.53,40.54) v1(16.53,39.27) v1(16.53,38) v1(16.53,36.73) v1(16.53,35.46) v1(16.53,34.19) v1(16.53,32.92) v1(16.53,31.65) v1(16.53,30.38) v1(16.53,29.11) v1(16.53,27.84) v1(16.53,26.57) v1(16.53,25.3) v1(17.8,41.81) v1(17.8,40.54) v1(17.8,39.27) v1(17.8,38) v1(17.8,36.73) v1(17.8,35.46) v1(17.8,34.19) v1(17.8,32.92) v1(17.8,31.65) v1(17.8,30.38) v1(17.8,29.11) v1(17.8,27.84) v1(17.8,26.57) v1(17.8,25.3)
NET4: length 5.8
  Top Layer w0.508: 16.04,49.66 16.27,49.89 R13.2 ; v1(26.92,42.93) 27.46,42.93 27.51,42.88
  Top Layer w1.524: Q5.2 24.38,51.49 U11.2
  vias: v1(1.63,54.3) v1(1.63,53.03) v1(2.9,56.84) v1(2.9,55.57) v1(4.17,58.11) v1(4.17,56.84) v1(4.17,55.57) v1(4.17,54.3) v1(5.44,58.11) v1(5.44,56.84) v1(5.44,55.57) v1(5.44,53.03) v1(6.71,59.38) v1(6.71,58.11) v1(6.71,56.84) v1(6.71,55.57) v1(6.71,53.03) v1(7.98,59.38) v1(7.98,58.11) v1(7.98,56.84) v1(7.98,55.57) v1(7.98,53.03) v1(9.25,59.38) v1(9.25,58.11) v1(9.25,56.84) v1(9.25,53.03) v1(10.52,59.38) v1(10.52,58.11) v1(10.52,56.84) v1(10.52,53.03) v1(11.79,59.38) v1(11.79,58.11) v1(11.79,56.84) v1(11.79,55.57) v1(11.79,53.03) v1(13.06,59.38) v1(13.06,58.11) v1(13.06,56.84) v1(13.06,55.57) v1(13.06,53.03) v1(14.33,59.38) v1(14.33,58.11) v1(14.33,56.84) v1(14.33,55.57) v1(14.33,53.03) v1(15.6,59.38) v1(15.6,58.11) v1(15.6,56.84) v1(15.6,55.57) v1(15.6,54.3) v1(16.87,59.38) v1(16.87,58.11) v1(16.87,56.84) v1(16.87,55.57) v1(16.87,54.3) v1(18.14,59.38) v1(18.14,58.11) v1(18.14,56.84) v1(18.14,55.57) v1(18.14,54.3) v1(21.65,50.1) v1(21.65,49.33) v1(21.65,48.57) v1(22.41,50.1) v1(22.41,49.33) v1(22.41,48.57) v1(22.41,47.94) v1(23.17,50.86) v1(23.17,50.1) v1(23.17,49.33) v1(23.17,48.57) v1(23.17,47.94) v1(23.17,47.18)
NET5: length 5.9
  Top Layer w0.508: R17.2 26.8,45.11 26.56,45.35 ; v1(19.56,34.42) 19.56,33.81 19.47,33.72
  Top Layer w1.524: U13.2 28.19,39.17 Q6.2
  vias: v1(23.73,37.85) v1(24.49,38.61) v1(24.49,37.85) v1(25.25,39.37) v1(25.25,38.61) v1(25.25,37.85) v1(26.01,39.37) v1(26.01,38.61) v1(26.01,37.85) v1(26.78,39.37) v1(26.78,38.61) v1(26.78,37.85) v1(29.87,60.29) v1(29.87,56.48) v1(29.87,55.21) v1(29.87,53.94) v1(29.87,52.67) v1(29.87,51.4) v1(29.87,50.13) v1(29.87,48.86) v1(29.87,47.59) v1(29.87,46.32) v1(31.14,60.29) v1(31.14,52.67) v1(31.14,50.13) v1(31.14,45.05) v1(31.14,43.78) v1(32.41,60.29) v1(32.41,59.02) v1(32.41,57.75) v1(32.41,56.48) v1(32.41,55.21) v1(32.41,53.94) v1(32.41,50.13) v1(32.41,48.86) v1(32.41,47.59) v1(32.41,46.32) v1(32.41,45.05) v1(32.41,43.78) v1(33.68,60.29) v1(33.68,59.02) v1(33.68,57.75) v1(33.68,56.48) v1(33.68,55.21) v1(33.68,53.94) v1(33.68,52.67) v1(33.68,51.4) v1(33.68,50.13) v1(33.68,48.86) v1(33.68,47.59) v1(33.68,46.32) v1(33.68,45.05) v1(33.68,43.78) v1(34.95,60.29) v1(34.95,59.02) v1(34.95,57.75) v1(34.95,56.48) v1(34.95,55.21) v1(34.95,53.94) v1(34.95,52.67) v1(34.95,51.4) v1(34.95,50.13) v1(34.95,48.86) v1(34.95,47.59) v1(34.95,46.32) v1(34.95,45.05) v1(34.95,43.78) v1(36.22,60.29) v1(36.22,59.02) v1(36.22,57.75) v1(36.22,56.48) v1(36.22,55.21) v1(36.22,53.94) v1(36.22,52.67) v1(36.22,51.4) v1(36.22,50.13) v1(36.22,48.86) v1(36.22,47.59) v1(36.22,46.32) v1(36.22,45.05) v1(36.22,43.78)
NET6: length 5.8
  Top Layer w0.508: 55.21,32.34 55.24,32.3 v1(55.24,31.62) ; 21.94,34.67 21.94,32.24 R21.2
  Top Layer w1.524: Q7.2 46.61,27.02 U15.2
  vias: v1(20.54,30.63) v1(20.54,29.36) v1(20.54,28.09) v1(20.54,26.82) v1(20.54,25.55) v1(21.81,30.63) v1(21.81,29.36) v1(21.81,28.09) v1(21.81,26.82) v1(21.81,25.55) v1(23.08,31.9) v1(23.08,28.09) v1(23.08,26.82) v1(23.08,25.55) v1(24.35,31.9) v1(24.35,28.09) v1(24.35,26.82) v1(24.35,25.55) v1(25.62,31.9) v1(25.62,28.09) v1(25.62,26.82) v1(25.62,25.55) v1(26.89,31.9) v1(26.89,30.63) v1(26.89,28.09) v1(26.89,26.82) v1(26.89,25.55) v1(28.16,31.9) v1(28.16,30.63) v1(28.16,26.82) v1(28.16,25.55) v1(29.43,31.9) v1(29.43,30.63) v1(29.43,28.09) v1(29.43,26.82) v1(29.43,25.55) v1(30.7,31.9) v1(30.7,28.09) v1(30.7,26.82) v1(30.7,25.55) v1(31.97,31.9) v1(31.97,28.09) v1(31.97,26.82) v1(31.97,25.55) v1(33.24,31.9) v1(33.24,28.09) v1(33.24,26.82) v1(33.24,25.55) v1(34.51,28.09) v1(34.51,26.82) v1(34.51,25.55) v1(35.78,28.09) v1(35.78,26.82) v1(35.78,25.55) v1(37.05,31.9) v1(37.05,30.63) v1(37.05,29.36) v1(37.05,28.09) v1(37.05,26.82) v1(37.05,25.55) v1(47.48,28.07) v1(48.24,28.07) v1(48.24,27.31) v1(48.24,26.55) v1(49,28.07) v1(49,27.31) v1(49,26.55) v1(49.76,28.07) v1(49.76,27.31) v1(49.76,26.55) v1(50.52,28.07) v1(50.52,27.31) v1(51.29,28.07)
NET7: length 5.9
  Top Layer w0.508: R25.2 52.97,31.62 52.74,31.39 ; 55.21,50.73 55.24,50.7 v1(55.24,50.04)
  Top Layer w1.524: Q8.2 46.61,45.29 U17.2
  vias: v1(38.95,40.79) v1(38.95,39.52) v1(38.95,38.25) v1(38.95,36.98) v1(40.22,40.79) v1(40.22,39.52) v1(40.22,38.25) v1(41.49,40.79) v1(41.49,39.52) v1(41.49,38.25) v1(41.49,34.44) v1(42.76,40.79) v1(42.76,39.52) v1(42.76,38.25) v1(42.76,34.44) v1(44.03,40.79) v1(44.03,39.52) v1(44.03,38.25) v1(44.03,34.44) v1(45.3,40.79) v1(45.3,39.52) v1(45.3,38.25) v1(45.3,35.71) v1(45.3,34.44) v1(46.57,40.79) v1(46.57,39.52) v1(46.57,38.25) v1(46.57,34.44) v1(47.48,46.36) v1(47.84,40.79) v1(47.84,39.52) v1(47.84,38.25) v1(47.84,35.71) v1(47.84,34.44) v1(48.24,46.36) v1(48.24,45.6) v1(48.24,44.84) v1(49,46.36) v1(49,45.6) v1(49,44.84) v1(49.11,40.79) v1(49.11,39.52) v1(49.11,38.25) v1(49.11,34.44) v1(49.76,46.36) v1(49.76,45.6) v1(49.76,44.84) v1(50.38,40.79) v1(50.38,39.52) v1(50.38,38.25) v1(50.38,34.44) v1(50.52,46.36) v1(50.52,45.6) v1(51.29,46.36) v1(51.65,40.79) v1(51.65,39.52) v1(51.65,38.25) v1(51.65,34.44) v1(52.92,40.79) v1(52.92,39.52) v1(52.92,38.25) v1(52.92,36.98) v1(52.92,35.71) v1(54.19,40.79) v1(54.19,39.52) v1(54.19,38.25) v1(54.19,36.98) v1(54.19,35.71) v1(55.46,40.79) v1(55.46,39.52) v1(55.46,38.25) v1(55.46,36.98) v1(55.46,35.71)
NET8: length 5.8
  Top Layer w0.508: 52.74,49.78 52.98,50.02 R29.2 ; 64.32,43 64.24,42.93 v1(63.63,42.93)
  Top Layer w1.524: Q9.2 59.05,51.43 U19.2
  vias: v1(38.95,59.46) v1(38.95,58.19) v1(38.95,56.92) v1(38.95,55.65) v1(38.95,54.38) v1(40.22,59.46) v1(40.22,58.19) v1(40.22,56.92) v1(40.22,55.65) v1(41.49,59.46) v1(41.49,58.19) v1(41.49,56.92) v1(41.49,55.65) v1(41.49,53.11) v1(42.76,59.46) v1(42.76,58.19) v1(42.76,56.92) v1(42.76,55.65) v1(42.76,53.11) v1(44.03,59.46) v1(44.03,58.19) v1(44.03,56.92) v1(44.03,55.65) v1(44.03,53.11) v1(45.3,59.46) v1(45.3,58.19) v1(45.3,56.92) v1(45.3,55.65) v1(45.3,53.11) v1(46.57,59.46) v1(46.57,58.19) v1(46.57,56.92) v1(46.57,53.11) v1(47.84,59.46) v1(47.84,58.19) v1(47.84,56.92) v1(47.84,54.38) v1(47.84,53.11) v1(49.11,59.46) v1(49.11,58.19) v1(49.11,56.92) v1(49.11,55.65) v1(49.11,53.11) v1(50.38,59.46) v1(50.38,58.19) v1(50.38,56.92) v1(50.38,55.65) v1(50.38,53.11) v1(51.65,59.46) v1(51.65,58.19) v1(51.65,56.92) v1(51.65,55.65) v1(51.65,53.11) v1(52.92,59.46) v1(52.92,58.19) v1(52.92,56.92) v1(52.92,55.65) v1(52.92,54.38) v1(54.19,59.46) v1(54.19,58.19) v1(54.19,56.92) v1(54.19,55.65) v1(54.19,54.38) v1(55.46,59.46) v1(55.46,58.19) v1(55.46,56.92) v1(55.46,55.65) v1(55.46,54.38) v1(58.51,50.02) v1(58.51,49.25) v1(58.51,48.49) v1(59.27,50.02) v1(59.27,49.25) v1(59.27,48.49) v1(59.27,47.73) v1(60.03,50.78) v1(60.03,50.02) v1(60.03,49.25) v1(60.03,48.49) v1(60.03,47.73) v1(60.03,46.97)
NET9: length 5.9
  Top Layer w0.508: v1(66.55,41.66) 65.89,41.66 65.73,41.49 ; R33.2 63.61,45.24 63.37,45.48
  Top Layer w1.524: Q10.2 71.04,33.02 U21.2
  vias: v1(66.7,56.6) v1(66.7,55.33) v1(66.7,54.06) v1(66.7,52.79) v1(66.7,51.52) v1(66.7,50.25) v1(66.7,48.98) v1(66.7,47.71) v1(66.7,46.44) v1(67.97,52.79) v1(67.97,50.25) v1(67.97,45.17) v1(67.97,43.9) v1(69.24,59.14) v1(69.24,57.87) v1(69.24,56.6) v1(69.24,55.33) v1(69.24,54.06) v1(69.24,52.79) v1(69.24,48.98) v1(69.24,47.71) v1(69.24,46.44) v1(69.24,45.17) v1(69.24,43.9) v1(69.85,37.7) v1(69.85,36.94) v1(69.85,36.17) v1(69.85,35.41) v1(69.85,34.65) v1(69.85,33.89) v1(70.51,57.87) v1(70.51,56.6) v1(70.51,55.33) v1(70.51,54.06) v1(70.51,52.79) v1(70.51,51.52) v1(70.51,50.25) v1(70.51,48.98) v1(70.51,47.71) v1(70.51,46.44) v1(70.51,45.17) v1(70.51,43.9) v1(70.62,36.94) v1(70.62,36.17) v1(70.62,35.41) v1(70.62,34.65) v1(71.38,36.17) v1(71.38,35.41) v1(71.38,34.65) v1(71.78,56.6) v1(71.78,55.33) v1(71.78,54.06) v1(71.78,52.79) v1(71.78,51.52) v1(71.78,50.25) v1(71.78,48.98) v1(71.78,47.71) v1(71.78,46.44) v1(71.78,45.17) v1(71.78,43.9) v1(73.05,55.33) v1(73.05,54.06) v1(73.05,52.79) v1(73.05,51.52) v1(73.05,50.25) v1(73.05,48.98) v1(73.05,47.71) v1(73.05,46.44) v1(73.05,45.17) v1(73.05,43.9)
NET10: length 5.9
  Top Layer w0.508: R37.2 66.44,39.26 66.67,39.02 ; 56.42,15.31 56.52,15.4 v1(56.52,16)
  Top Layer w1.524: Q11.2 65.02,20.75 U23.2
  vias: v1(57.55,41.49) v1(57.55,40.22) v1(57.55,38.95) v1(57.55,37.68) v1(57.55,36.41) v1(57.55,35.14) v1(57.55,33.87) v1(57.55,32.6) v1(57.55,31.33) v1(57.55,30.06) v1(57.55,28.79) v1(57.55,27.52) v1(57.55,26.25) v1(57.55,24.98) v1(58.82,41.49) v1(58.82,40.22) v1(58.82,38.95) v1(58.82,37.68) v1(58.82,36.41) v1(58.82,35.14) v1(58.82,33.87) v1(58.82,32.6) v1(58.82,31.33) v1(58.82,30.06) v1(58.82,28.79) v1(58.82,27.52) v1(58.82,26.25) v1(58.82,24.98) v1(60.09,41.49) v1(60.09,40.22) v1(60.09,38.95) v1(60.09,37.68) v1(60.09,36.41) v1(60.09,35.14) v1(60.09,33.87) v1(60.09,31.33) v1(60.09,30.06) v1(60.09,28.79) v1(60.09,27.52) v1(60.09,26.25) v1(60.09,24.98) v1(60.56,19.44) v1(61.32,20.2) v1(61.32,19.44) v1(61.36,41.49) v1(61.36,40.22) v1(61.36,38.95) v1(61.36,24.98) v1(62.08,20.96) v1(62.08,20.2) v1(62.08,19.44) v1(62.63,41.49) v1(62.63,40.22) v1(62.63,38.95) v1(62.63,33.87) v1(62.63,32.6) v1(62.63,24.98) v1(62.84,20.96) v1(62.84,20.2) v1(62.84,19.44) v1(63.61,20.96) v1(63.61,20.2) v1(63.61,19.44) v1(63.9,37.68) v1(63.9,36.41) v1(63.9,35.14) v1(63.9,33.87) v1(63.9,32.6) v1(63.9,31.33) v1(63.9,30.06) v1(63.9,28.79) v1(63.9,27.52)
NET11: length 6.1
  Top Layer w0.508: v1(48.13,23.37) 47.39,23.37 47.31,23.29 ; 58.89,16.26 58.89,13.82 R41.2
  Top Layer w1.524: Q12.2 52.71,14.6 U25.2
  vias: v1(51.44,19.28) v1(51.44,18.52) v1(51.44,17.76) v1(51.44,17) v1(51.44,16.23) v1(51.44,15.47) v1(52.2,18.52) v1(52.2,17.76) v1(52.2,17) v1(52.2,16.23) v1(52.2,15.47) v1(52.96,17.76) v1(52.96,17) v1(52.96,16.23) v1(57.49,12.21) v1(57.49,10.94) v1(57.49,9.67) v1(57.49,8.4) v1(57.49,7.13) v1(58.76,12.21) v1(58.76,10.94) v1(58.76,9.67) v1(58.76,8.4) v1(58.76,7.13) v1(60.03,13.48) v1(60.03,9.67) v1(60.03,8.4) v1(60.03,7.13) v1(61.3,13.48) v1(61.3,9.67) v1(61.3,8.4) v1(61.3,7.13) v1(62.57,13.48) v1(62.57,9.67) v1(62.57,8.4) v1(62.57,7.13) v1(63.84,13.48) v1(63.84,12.21) v1(63.84,9.67) v1(63.84,8.4) v1(63.84,7.13) v1(65.11,13.48) v1(65.11,12.21) v1(65.11,8.4) v1(65.11,7.13) v1(66.38,13.48) v1(66.38,12.21) v1(66.38,10.94) v1(66.38,9.67) v1(66.38,8.4) v1(66.38,7.13) v1(67.65,13.48) v1(67.65,9.67) v1(67.65,8.4) v1(67.65,7.13) v1(68.92,13.48) v1(68.92,9.67) v1(68.92,8.4) v1(68.92,7.13) v1(70.19,13.48) v1(70.19,9.67) v1(70.19,8.4) v1(70.19,7.13) v1(71.46,9.67) v1(71.46,8.4) v1(71.46,7.13) v1(72.73,12.21) v1(72.73,9.67) v1(72.73,8.4) v1(72.73,7.13) v1(74,13.48) v1(74,12.21) v1(74,10.94) v1(74,9.67)
$1N471: length 2
  Top Layer w1: LED1.1 R2.1
$1N732: length 15.5
  Top Layer w0.7: 32.34,12.26 31.32,12.26 30.31,13.27 30.31,17.08 R3.1 ; 32.34,12.26 R4.1 ; 32.34,12.26 34.97,12.26 Q1.3
  Top Layer w1: R4.1 31.34,11.22 LED1.2
$1N777: length 15.4
  Top Layer w0.6: R1.1 28.05,22.22 29.69,22.22 30.8,23.33 36.26,17.87 Q1.1
$1N2020: length 2
  Top Layer w1: LED2.1 R6.1
$1N2021: length 15.5
  Top Layer w0.7: R8.1 12.23,12.55 8.42,12.55 7.41,11.54 7.41,10.52 ; R7.1 7.41,10.52 ; 7.41,10.52 7.41,8.02 Q2.3
  Top Layer w1: R7.1 6.37,11.52 LED2.2
$1N2022: length 15.4
  Top Layer w0.6: Q2.1 12.96,6.67 18.42,12.13 17.27,13.28 17.27,14.83 R5.1
$1N2372: length 2
  Top Layer w1: LED3.1 R10.1
$1N2373: length 16.6
  Top Layer w0.7: Q3.3 4.21,36.45 R11.1
  Top Layer w1: R11.1 6.82,36.56 LED3.2
  Top Layer w1.016: R11.1 8.38,34.78 8.38,30.73 7.11,29.47 R12.1
$1N2374: length 15.2
  Top Layer w0.6: Q3.1 1.72,29.88 7.18,24.42 8.28,25.53 9.8,25.53 R9.1
$1N2721: length 2
  Top Layer w1: LED4.1 R14.1
$1N2722: length 15.5
  Top Layer w0.7: 7.37,47.23 7.37,48.24 8.38,49.26 12.19,49.26 R16.1 ; 7.37,47.23 R15.1 ; 7.37,47.23 7.37,44.72 Q4.3
  Top Layer w1: R15.1 6.33,48.23 LED4.2
$1N2723: length 15.5
  Top Layer w0.6: Q4.1 13.27,43.37 18.51,48.61 18.51,48.71 17.4,49.81 17.4,51.45 R13.1
$1N3070: length 2
  Top Layer w1: LED5.1 R18.1
$1N3071: length 16.3
  Top Layer w0.7: Q5.3 23.02,55.42 24.64,55.42 R19.1 ; R20.1 26.27,49.18 26.27,54 25.26,55.02
  Top Layer w1: R19.1 25.26,55.02 LED5.2
$1N3072: length 15.4
  Top Layer w0.6: Q5.1 20.15,48.34 25.61,42.88 26.8,44.07 28.27,44.07 R17.1
$1N3398: length 2
  Top Layer w1: LED6.1 R22.1
$1N3399: length 16
  Top Layer w0.7: Q6.3 31.62,38.72 R23.1 ; R24.1 25.8,34.92 30.68,34.92 31.73,35.98
  Top Layer w1: LED6.2 31.73,35.98 R23.1
$1N3400: length 15.4
  Top Layer w0.6: Q6.1 24.93,41.08 19.47,35.62 20.57,34.51 20.57,32.88 R21.1
$1N3726: length 2
  Top Layer w1: LED7.1 R26.1
$1N3727: length 15.7
  Top Layer w0.7: R27.1 43.18,27.47 Q7.3 ; 43.07,30.08 44.08,31.1 48.91,31.1 R28.1
  Top Layer w1: LED7.2 43.07,30.08 R27.1
$1N3728: length 15.3
  Top Layer w0.6: R25.1 54.1,33.18 54.1,31.55 55.21,30.44 49.88,25.1 Q7.1
$1N4054: length 2
  Top Layer w1: LED8.1 R30.1
$1N4055: length 15.7
  Top Layer w0.7: R31.1 43.31,45.61 Q8.3
  Top Layer w1: LED8.2 43.2,48.48 R31.1
  Top Layer w1.016: R32.1 48.91,49.5 44.21,49.5 43.2,48.48
$1N4056: length 15.4
  Top Layer w0.6: Q8.1 49.75,43.37 55.21,48.83 53.98,50.07 53.98,51.45 R29.1
$1N4382: length 2
  Top Layer w1: LED9.1 R34.1
$1N4383: length 15.7
  Top Layer w0.7: 62.07,55.02 63.08,54 63.08,49.18 R36.1 ; Q9.3 59.45,54.91 R35.1
  Top Layer w1: R35.1 62.07,55.02 LED9.2
$1N4384: length 15.2
  Top Layer w0.6: Q9.1 57.09,48.34 62.42,43 63.61,44.2 65.08,44.2 R33.1
$1N4710: length 2
  Top Layer w1: LED10.1 R38.1
$1N4711: length 15.5
  Top Layer w0.7: R40.1 67.07,35.43 67.07,31.86 68.45,30.48 69.11,30.48 ; 69.11,30.48 71.48,30.48 Q10.3 ; 69.11,30.48 R39.1
  Top Layer w1: LED10.2 67.98,29.35 R39.1
$1N4712: length 15.1
  Top Layer w0.6: R37.1 64.88,40.39 66.52,40.39 67.63,41.49 72.96,36.16 Q10.1
$1N5038: length 2
  Top Layer w1: LED11.1 R42.1
$1N5039: length 15.8
  Top Layer w0.7: Q11.3 68.45,20.3 R43.1 ; 68.56,17.56 67.55,16.54 62.72,16.54 R44.1
  Top Layer w1: R43.1 68.56,17.56 LED11.2
$1N5040: length 15.3
  Top Layer w0.6: R41.1 57.53,14.46 57.53,16.1 56.42,17.21 61.88,22.67 Q11.1
$1N5366: length 2
  Top Layer w1: 47.46,7.83 R46.1
$1N5367: length 16
  Top Layer w0.7: Q12.3 52.31,11.13 R47.1 ; R48.1 48.55,16.99 48.55,12.04 49.56,11.02
  Top Layer w1: LED12.2 49.56,11.02 R47.1
$1N5368: length 15.5
  Top Layer w0.6: R45.1 46.55,22.1 48.02,22.1 49.21,23.29 54.67,17.83 Q12.1

## Copper pours and planes (outline as drawn; the poured copper is in the pictures)
GND on Top Layer: 31.91,19.81 35.4,19.81 35.4,13.72 31.91,13.72
GND on Bottom Layer: 28.32,23.88 37.34,23.88 37.34,-3.31 28.32,-3.31
VCC on Top Layer: 46.31,23.89 46.31,-3.19 37.64,-3.19 37.64,23.89
VCC on Bottom Layer: 37.59,23.88 46.36,23.88 46.36,-3.18 37.59,-3.18
NET1 on Top Layer: 8.89,7.4 8.89,10.89 14.98,10.89 14.98,7.4
NET1 on Top Layer: 19.16,6.66 19.16,23.82 28.08,23.82 28.08,6.66
NET1 on Bottom Layer: 28.32,23.88 28.32,-3.18 0.89,-3.18 -0.76,-1.52 -0.76,14.6 19.06,14.6 19.06,23.87 19.05,23.88
NET2 on Top Layer: 0.18,23.64 18.87,23.64 18.87,14.84 0.18,14.84
NET2 on Top Layer: 2.06,34.22 6.07,34.22 6.07,27.75 2.06,27.75
NET2 on Bottom Layer: 19.05,23.62 19.05,14.6 0.25,14.6 0.25,42.16 9.78,42.16 9.78,23.62
NET3 on Top Layer: 10.08,23.93 10.08,42.24 18.87,42.24 18.87,23.93
NET3 on Top Layer: 8.7,43.84 8.7,47.34 14.92,47.34 14.92,43.84
NET3 on Bottom Layer: 18.92,23.88 18.92,51.43 0.13,51.43 0.38,51.18 0.38,42.16 9.91,42.16 9.91,23.83 18.88,23.83
NET4 on Top Layer: 0.25,60.83 18.95,60.83 18.95,51.66 0.25,51.66
NET4 on Top Layer: 20.78,52.4 24.28,52.4 24.28,46.31 20.78,46.31
NET4 on Bottom Layer: 0.25,51.43 0.25,61.98 27.69,61.98 28.19,61.47 28.19,42.31 19.18,42.31 19.18,51.56 0.38,51.56
NET5 on Top Layer: 28.5,42.41 28.5,60.84 37.29,60.84 37.29,42.41
NET5 on Top Layer: 22.86,36.99 22.86,40.48 28.95,40.48 28.95,36.99
NET5 on Bottom Layer: 28.32,60.83 37.34,60.83 37.34,33.02 19.19,33.02 19.19,42.15 19.18,42.16 28.32,51.31
NET6 on Top Layer: 37.48,24.18 19.17,24.18 19.17,32.72 37.48,32.72
NET6 on Top Layer: 45.85,25.68 45.85,29.18 51.94,29.18 51.94,25.68
NET6 on Bottom Layer: 19.05,32.77 55.88,32.77 55.88,24.13 19.05,24.13
NET7 on Top Layer: 45.85,43.97 45.85,47.47 51.94,47.47 51.94,43.97
NET7 on Top Layer: 55.89,33.07 37.58,33.07 37.58,41.61 55.89,41.61
NET7 on Bottom Layer: 37.61,51.43 55.88,51.43 55.88,33.02 37.61,33.02
NET8 on Top Layer: 57.56,52.19 61.06,52.19 61.06,46.1 57.56,46.1
NET8 on Top Layer: 55.89,51.74 37.58,51.74 37.58,60.78 55.89,60.78
NET8 on Bottom Layer: 65.02,60.83 65.02,42.29 56.01,42.29 56.01,51.43 37.59,51.43 37.46,51.56 37.46,60.83
NET9 on Top Layer: 68.99,38.35 72.49,38.35 72.49,32.26 68.99,32.26
NET9 on Top Layer: 74.5,60.84 74.5,42.53 65.33,42.53 65.33,60.84
NET9 on Bottom Layer: 65.15,60.83 74.42,60.83 74.42,23.88 65.15,23.88
NET10 on Top Layer: 64.85,42.05 64.85,23.61 56.18,23.61 56.18,42.05
NET10 on Top Layer: 59.69,18.57 59.69,22.07 65.78,22.07 65.78,18.57
NET10 on Bottom Layer: 56.13,42.16 74.55,42.16 74.55,14.6 56.13,14.6
NET11 on Top Layer: 74.43,6.78 56.12,6.78 56.12,14.3 74.43,14.3
NET11 on Top Layer: 50.58,19.93 54.07,19.93 54.07,13.85 50.58,13.85
NET11 on Bottom Layer: 46.61,23.88 76.96,23.88 76.96,-7.87 46.61,-7.87
$1N732 on Top Layer: 28.32,19.71 36.7,19.71 36.7,6.71 28.32,6.71
$1N2021 on Top Layer: 0.23,6.22 0.23,14.6 15.01,14.6 15.01,6.22
$1N2373 on Top Layer: 1.4,42.06 9.78,42.06 9.78,27.53 1.4,27.53
$1N2722 on Top Layer: 0.36,43 0.36,51.38 14.88,51.38 14.88,43
$1N3071 on Top Layer: 19.81,60.83 28.19,60.83 28.19,46.31 19.81,46.31
$1N3399 on Top Layer: 22.84,33.02 22.84,41.4 37.36,41.4 37.36,33.02
$1N3727 on Top Layer: 37.7,24.64 37.7,32.77 52.09,32.77 52.09,24.64
$1N4055 on Top Layer: 37.7,43.05 37.7,51.43 52.22,51.43 52.22,43.05
$1N4383 on Top Layer: 56.52,60.73 64.9,60.73 64.9,46.2 56.52,46.2
$1N4711 on Top Layer: 65.15,38.25 73.53,38.25 73.53,23.72 65.15,23.72
$1N5039 on Top Layer: 59.67,14.54 59.67,22.92 74.45,22.92 74.45,14.54
$1N5367 on Top Layer: 46.61,20.22 54.99,20.22 54.99,6.71 46.61,6.71

## Text on the board
Bottom Silkscreen Layer: RM2000 28.28V BANK / (TRAINING ONLY) | COOKED BY: WEI
Top Silkscreen Layer: RM2000 28.28V BANK / (TRAINING ONLY) | NUS CALIBUR / ROBOTICS
